# EAGLE design module (EAGLE 7.7.0)
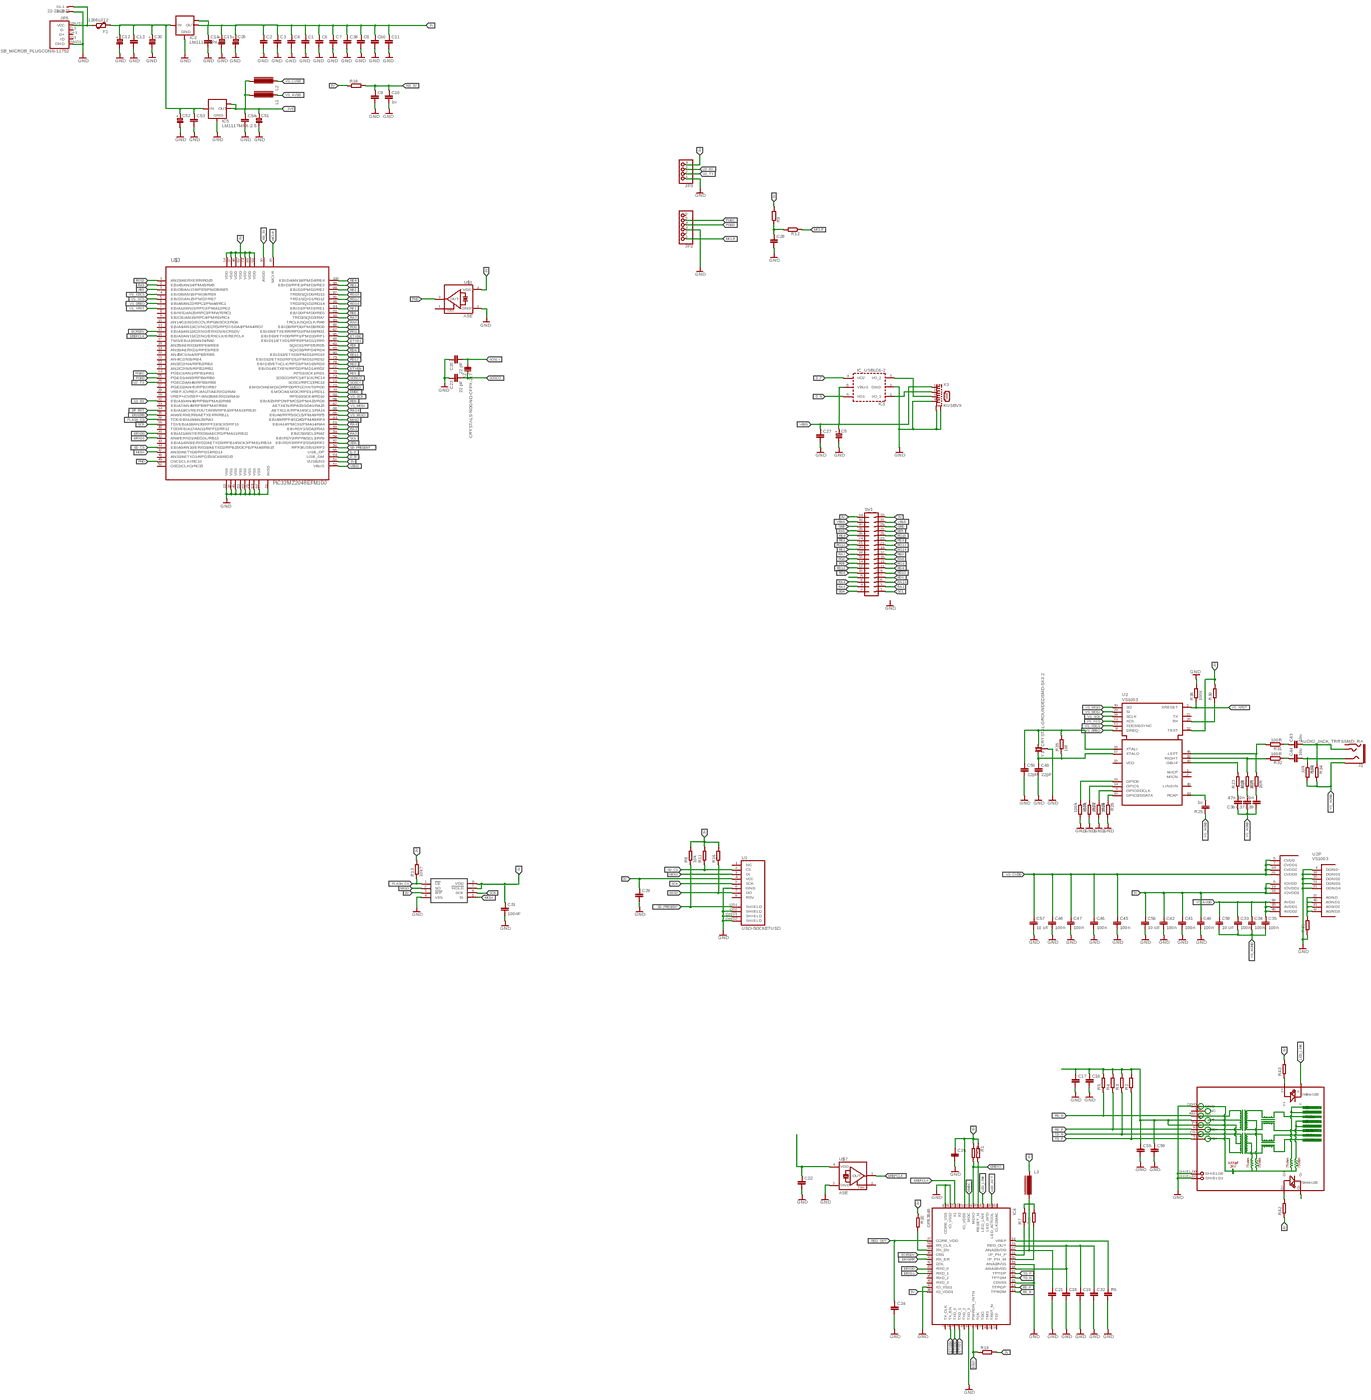
[diagram p0: schematic, sheet 1, overview]
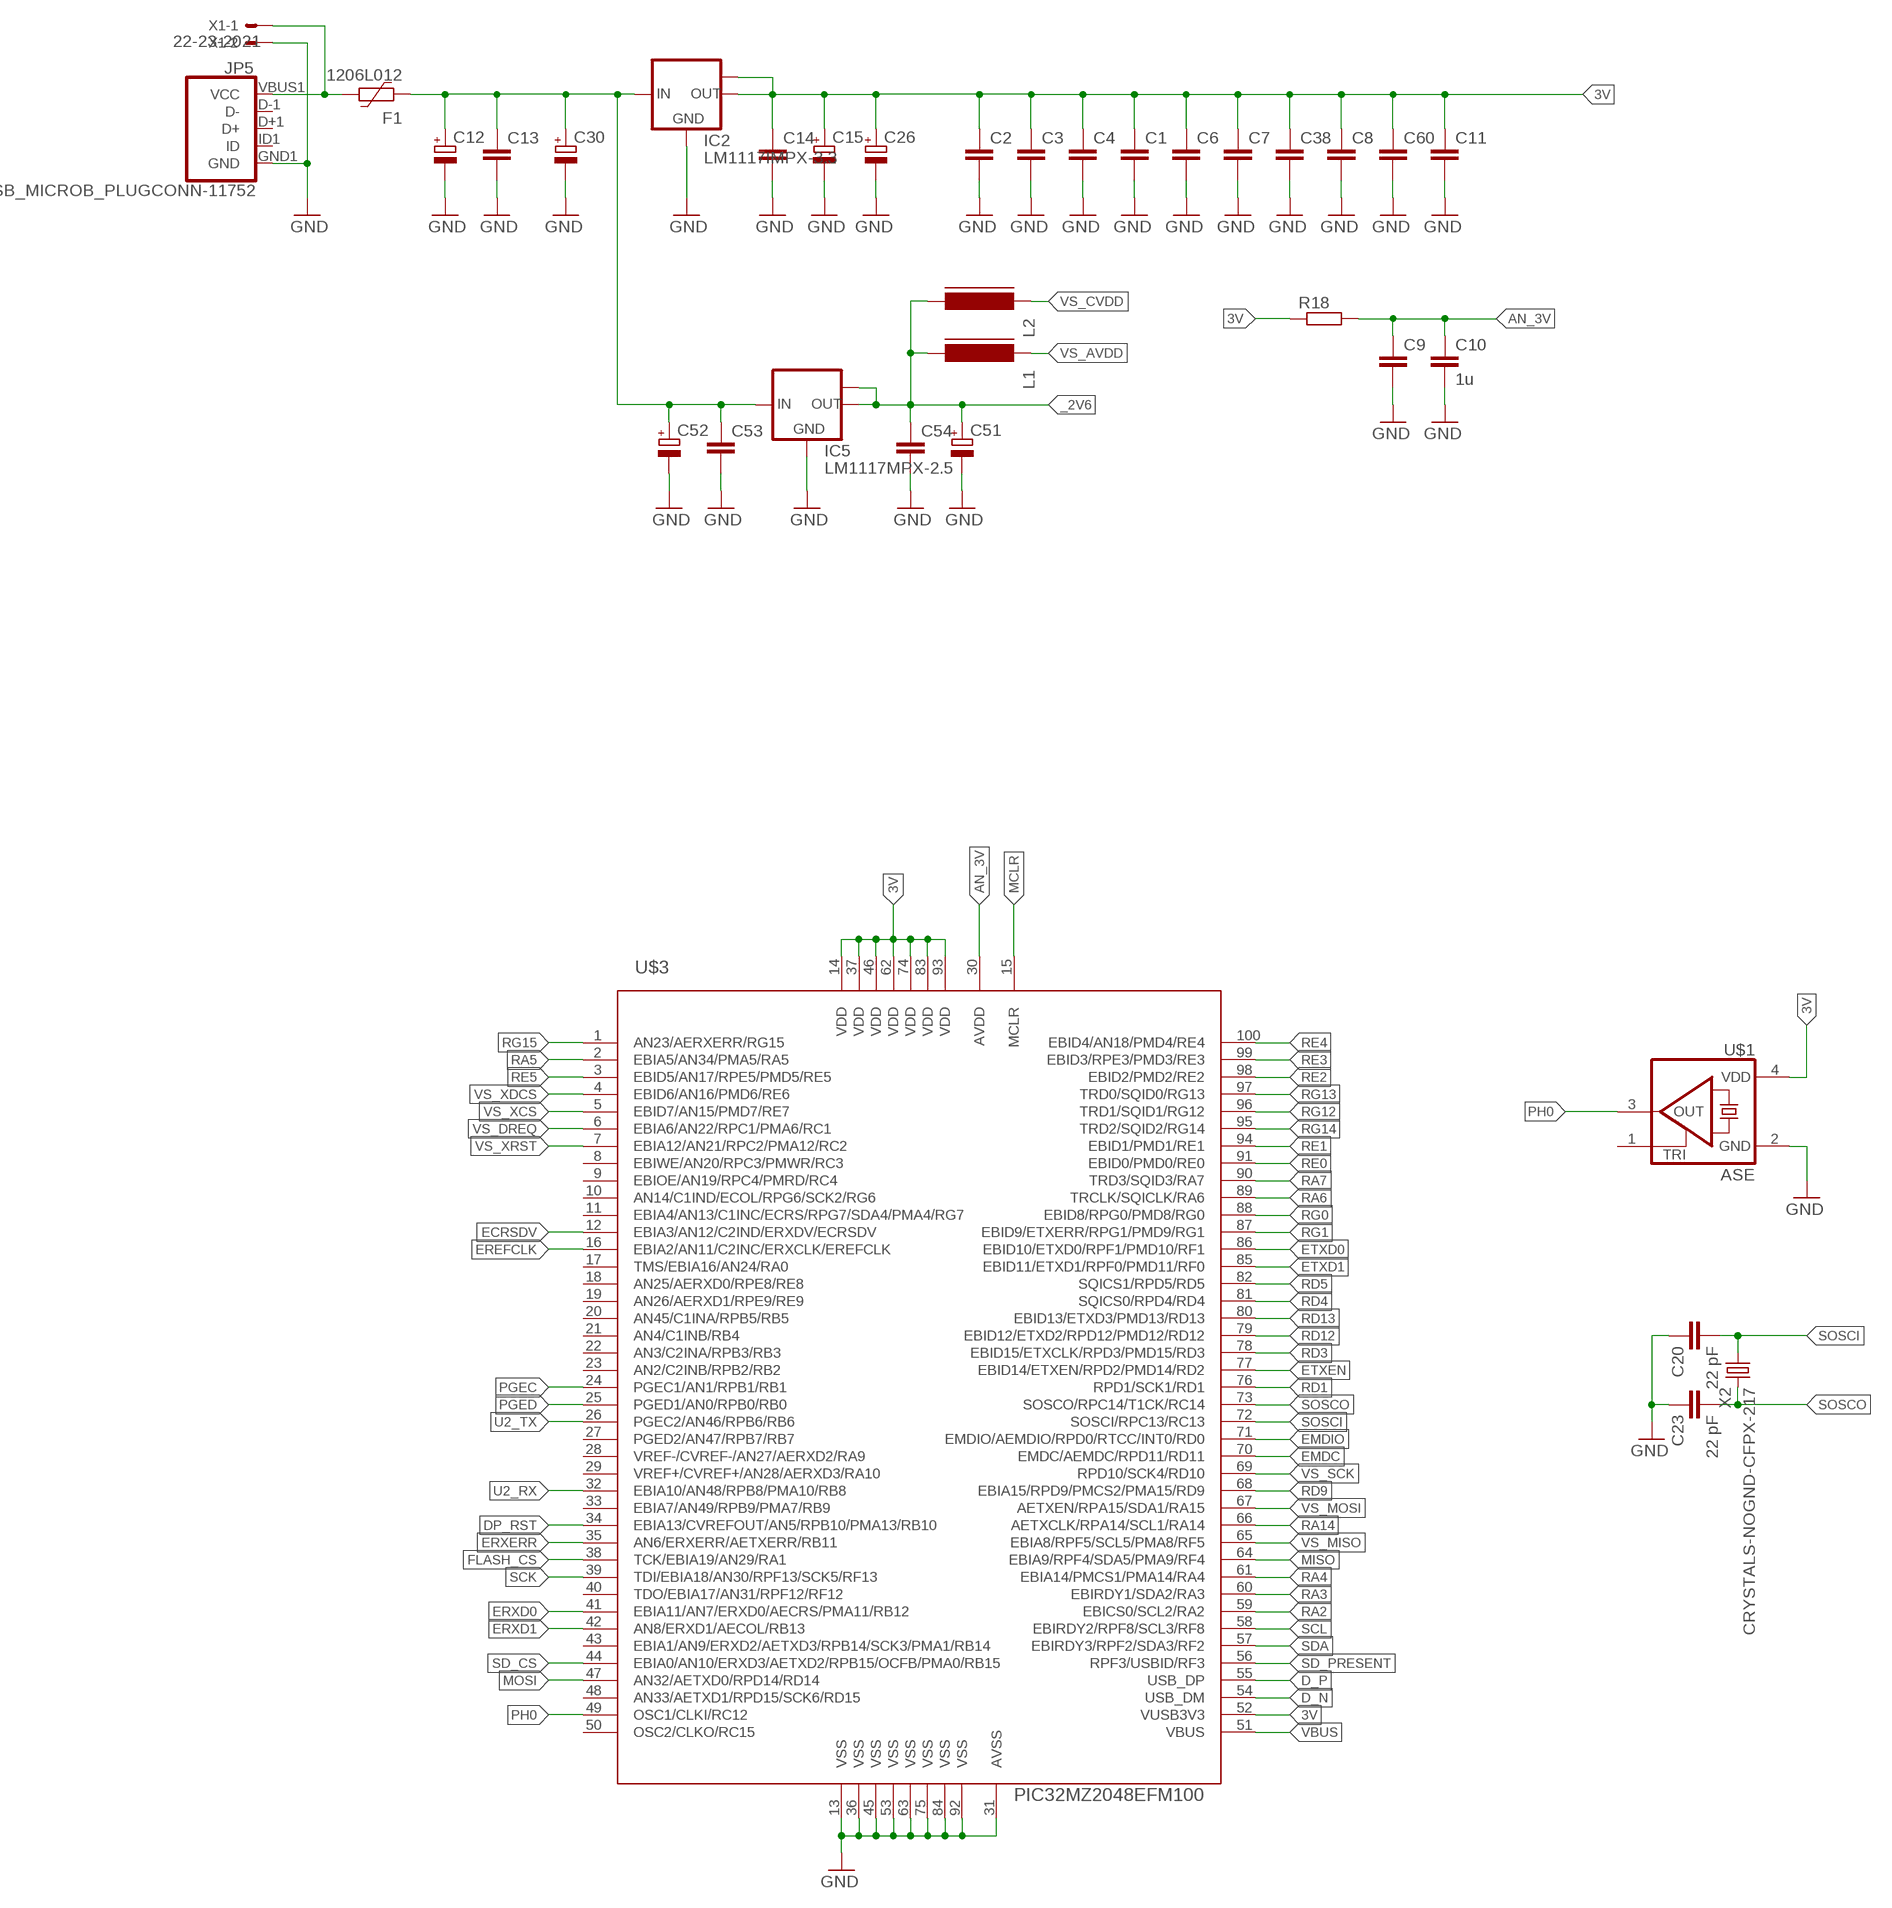
[diagram p1: schematic, sheet 1, part 1 of 4]
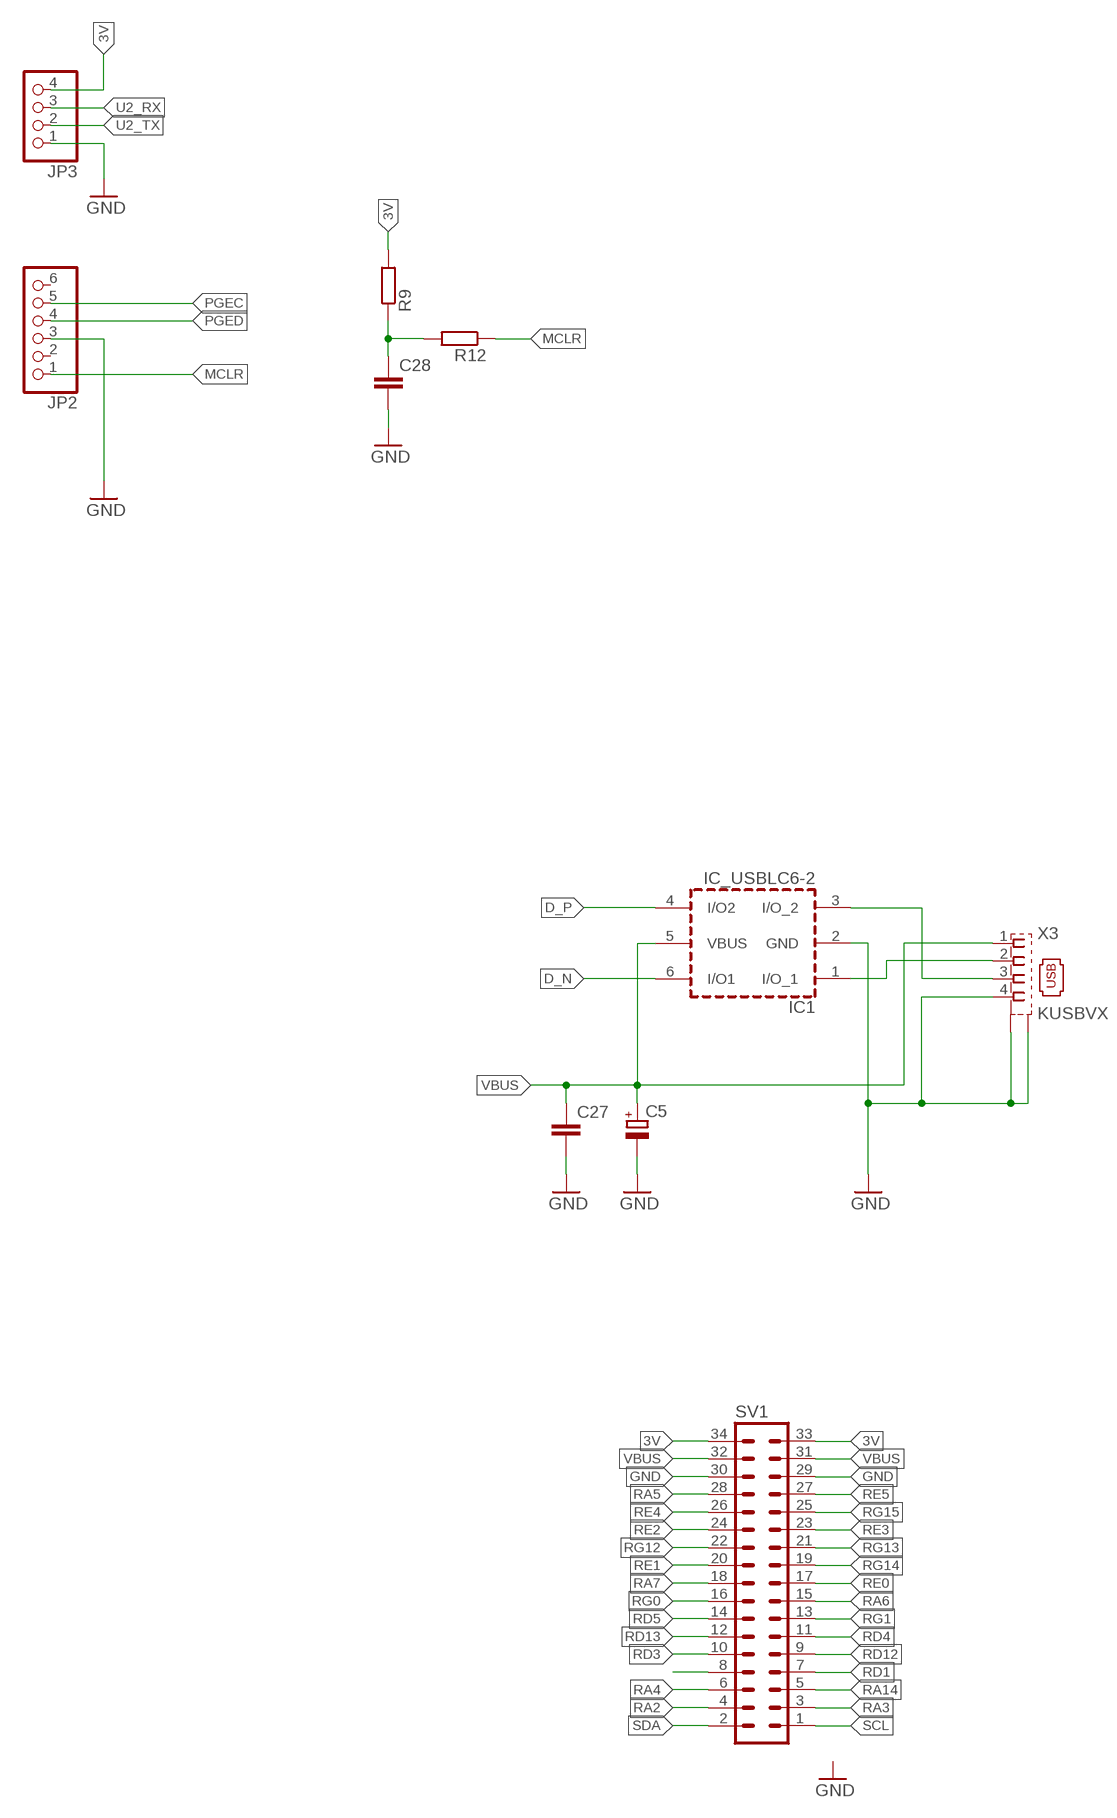
[diagram p2: schematic, sheet 1, part 2 of 4]
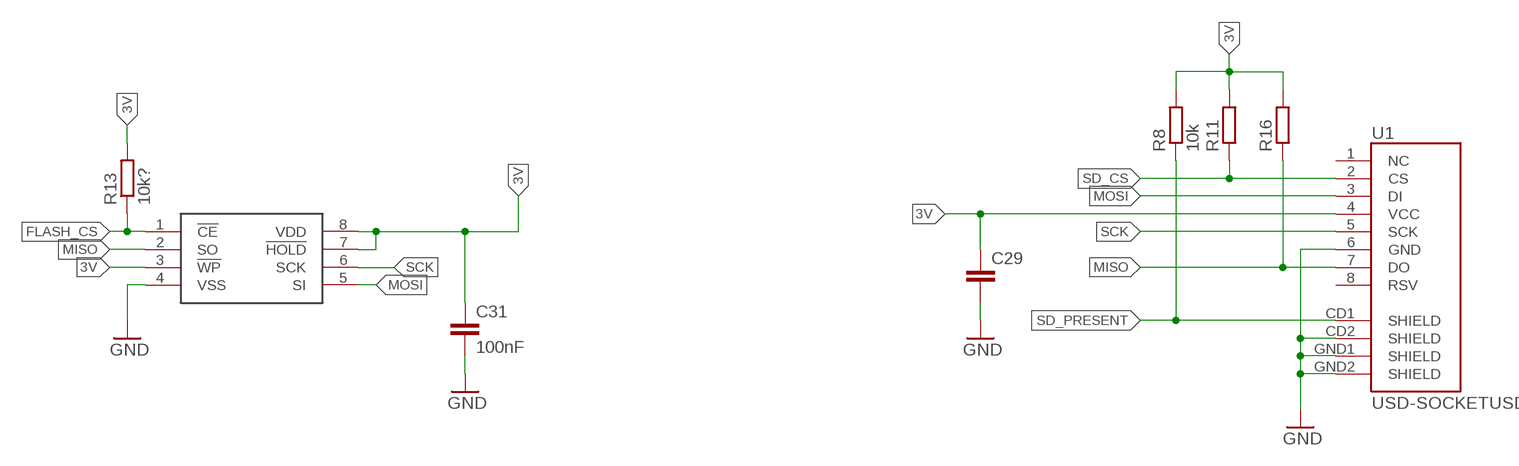
[diagram p3: schematic, sheet 1, part 3 of 4]
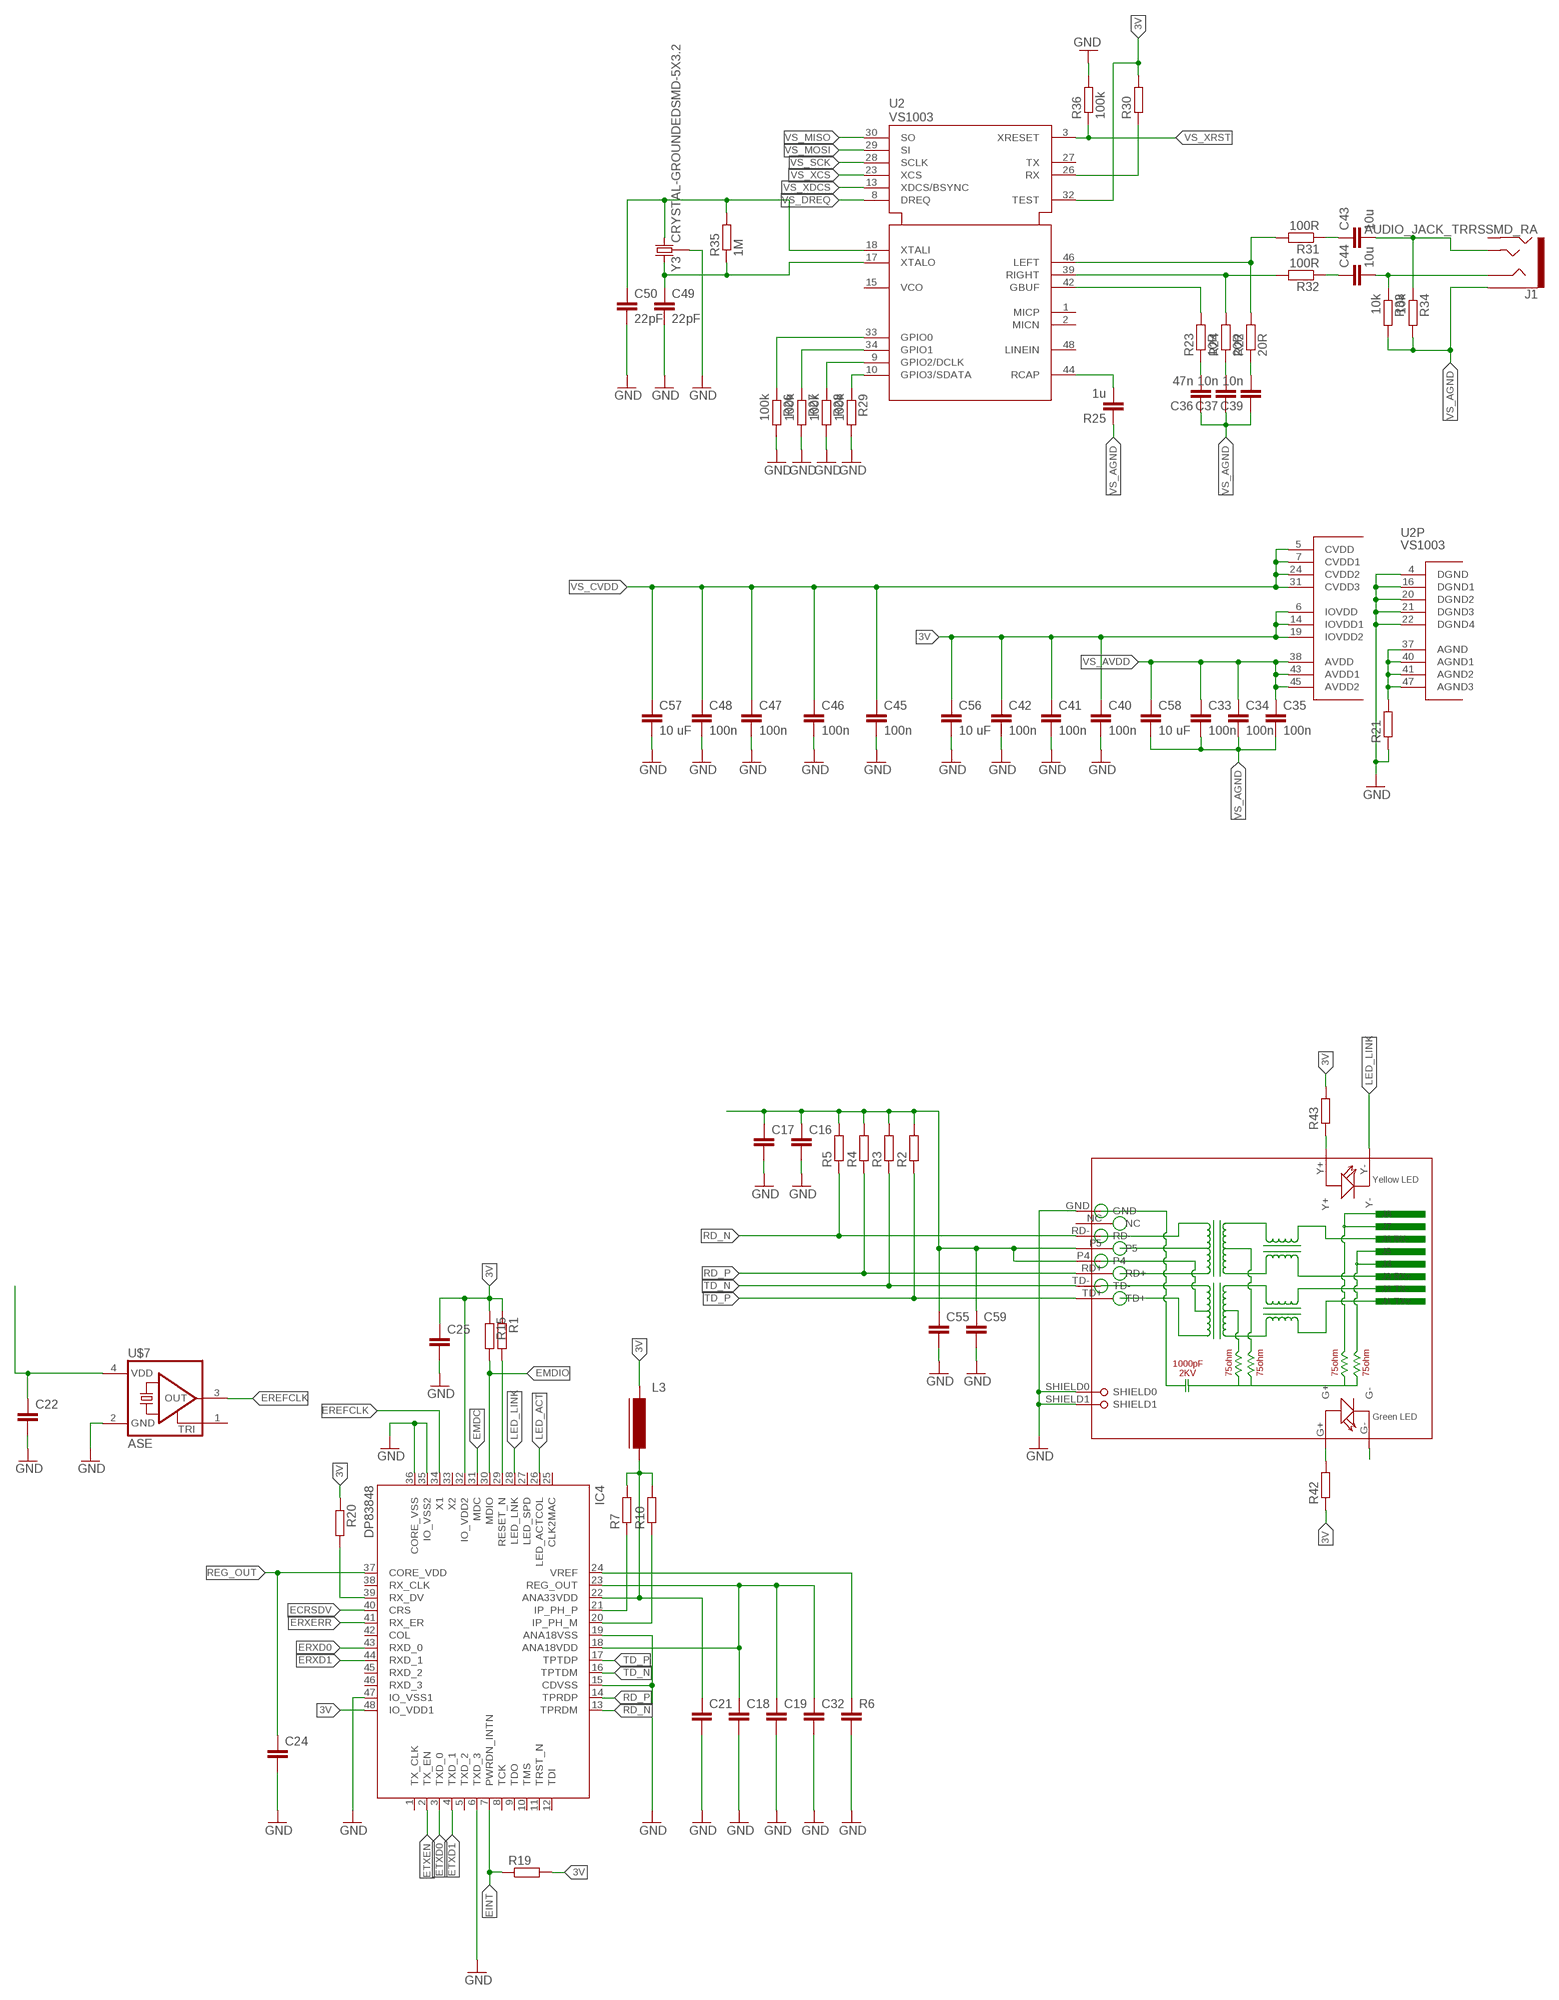
[diagram p4: schematic, sheet 1, part 4 of 4]

## Parts
C1  C-EUC0402  [C0402]
C2  C-EUC0402  [C0402]
C3  C-EUC0402  [C0402]
C4  C-EUC0402  [C0402]
C5  CPOL-EUSMCA  [SMC_A]
C6  C-EUC0402  [C0402]
C7  C-EUC0402  [C0402]
C8  C-EUC0402  [C0402]
C9  C-EUC0402  [C0402]
C10  1u  C-EUC0603  [C0603]
C11  C-EUC0402  [C0402]
C12  CPOL-EUSMCB  [SMC_B]
C13  C-EUC0603  [C0603]
C14  C-EUC0603  [C0603]
C15  CPOL-EUSMCB  [SMC_B]
C16  C-EUC0603  [C0603]
C17  C-EUC0603  [C0603]
C18  C-EUC0402  [C0402]
C19  C-EUC0402  [C0402]
C20  22 pF  C-EUC0603  [C0603]
C21  C-EUC0402  [C0402]
C22  C-EUC0402  [C0402]
C23  22 pF  C-EUC0603  [C0603]
C24  C-EUC0603  [C0603]
C25  C-EUC0603  [C0603]
C26  CPOL-EUSMCA  [SMC_A]
C27  C-EUC0603  [C0603]
C28  C-EUC0603  [C0603]
C29  C-EUC0603  [C0603]
C30  CPOL-EUSMCA  [SMC_A]
C31  100nF  C-EUC0603  [C0603]
C32  C-EUC0603  [C0603]
C33  100n  C-EUC0603  [C0603]
C34  100n  C-EUC0603  [C0603]
C35  100n  C-EUC0603  [C0603]
C36  47n  C-EUC0603  [C0603]
C37  10n  C-EUC0603  [C0603]
C38  C-EUC0402  [C0402]
C39  10n  C-EUC0603  [C0603]
C40  100n  C-EUC0402  [C0402]
C41  100n  C-EUC0402  [C0402]
C42  100n  C-EUC0402  [C0402]
C43  10u  C-EUC0603  [C0603]
C44  10u  C-EUC0603  [C0603]
C45  100n  C-EUC0402  [C0402]
C46  100n  C-EUC0603  [C0603]
C47  100n  C-EUC0603  [C0603]
C48  100n  C-EUC0603  [C0603]
C49  22pF  C-EUC0603  [C0603]
C50  22pF  C-EUC0603  [C0603]
C51  CPOL-EUSMCB  [SMC_B]
C52  CPOL-EUSMCB  [SMC_B]
C53  C-EUC1206  [C1206]
C54  C-EUC1206  [C1206]
C55  C-EUC0603  [C0603]
C56  10 uF  C-EUC0603  [C0603]
C57  10 uF  C-EUC0603  [C0603]
C58  10 uF  C-EUC0603  [C0603]
C59  C-EUC0603  [C0603]
C60  C-EUC0402  [C0402]
F1  1206L012  [1206L]
IC1  IC_USBLC6-2  [SOT-23-6L]
IC2  LM1117IMPX-3.3  [SOT223]
IC4  DP83848  [LQFP48]
IC5  LM1117MPX-2.5  [SOT223]
J1  AUDIO_JACK_TRRSSMD_RA  [AUDIO_JACK_3.5MM_TRRS_SMD_RA]
JP2  PINHD-1X6  [1X06]
JP3  PINHD-1X4  [1X04]
JP5  USB_MICROB_PLUGCONN-11752  [USB-B-MICRO-SMD_V03]
L1  FERRITE-0805  [FB805]
L2  FERRITE-0805  [FB805]
L3  FERRITE-0805  [FB805]
R1  R-EU_R0402  [R0402]
R2  R-EU_R0603  [R0603]
R3  R-EU_R0603  [R0603]
R4  R-EU_R0603  [R0603]
R5  R-EU_R0603  [R0603]
R6  C-EUC0603  [C0603]
R7  R-EU_R0402  [R0402]
R8  10k  R-EU_R0603  [R0603]
R9  R-EU_R0603  [R0603]
R10  R-EU_R0402  [R0402]
R11  R-EU_R0603  [R0603]
R12  R-EU_R0402  [R0402]
R13  10k?  R-EU_R0603  [R0603]
R15  R-EU_R0603  [R0603]
R16  R-EU_R0603  [R0603]
R18  R-EU_R0805  [R0805]
R19  R-EU_R0402  [R0402]
R20  R-EU_R0603  [R0603]
R21  R-EU_R0603  [R0603]
R22  20R  R-EU_R0603  [R0603]
R23  10R  R-EU_R0603  [R0603]
R24  20R  R-EU_R0603  [R0603]
R25  1u  C-EUC0603  [C0603]
R26  100k  R-EU_R0402  [R0402]
R27  100k  R-EU_R0402  [R0402]
R28  100k  R-EU_R0402  [R0402]
R29  100k  R-EU_R0402  [R0402]
R30  R-EU_0204/7  [0204/7]
R31  100R  R-EU_R0603  [R0603]
R32  100R  R-EU_R0603  [R0603]
R33  10k  R-EU_R0603  [R0603]
R34  10k  R-EU_R0603  [R0603]
R35  1M  R-EU_R0603  [R0603]
R36  100k  R-EU_R0603  [R0603]
R42  R-EU_R0603  [R0603]
R43  R-EU_R0603  [R0603]
RJ1  HR911105A  [HR911105A]
SV1  ML34L  [ML34L]
U1  USD-SOCKETUSD  [USD-SOCKET-PP]
U2  VS1003  [LQFP48]
U$1  ASE  [ASE]
U$2  SST25VF016BSO8M  [SO-08M]
U$3  PIC32MZ2048EFM100  [TQFP100_12X12]
U$7  ASE  [ASE]
X1  22-23-2021  [22-23-2021]
X2  CRYSTALS-NOGND-CFPX-217  [3.2X1.5-2-PAD]
X3  KUSBVX  [KUSBVX]
Y3  CRYSTAL-GROUNDEDSMD-5X3.2  [CRYSTAL-SMD-5X3.2-4PAD]

## Nets
3V: C1.1 C2.1 C3.1 C4.1 C6.1 C7.1 C8.1 C11.1 C14.1 C15.+ C22.1 C25.1 C26.+ C29.1 C31.1 C38.1 C40.1 C41.1 C42.1 C56.1 C60.1 IC2.2(OUT) IC2.TAB(OUT1) IC4.32(IO_VDD2) IC4.48(IO_VDD1) JP3.4 L3.1 R1.1 R8.2 R9.2 R11.2 R13.2 R15.1 R16.2 R18.1 R19.2 R20.1 R30.2 R42.1 R43.2 SV1.33 SV1.34 U1.4(VCC) U2.6(IOVDD) U2.14(IOVDD1) U2.19(IOVDD2) U2.32(TEST) U$1.4(VDD) U$2.3(!WP) U$2.7(!HOLD) U$2.8(VDD) U$3.14(VDD) U$3.37(VDD) U$3.46(VDD) U$3.52(VUSB3V3) U$3.62(VDD) U$3.74(VDD) U$3.83(VDD) U$3.93(VDD) U$7.4(VDD)
_2V6: C51.+ C54.1 IC5.2(OUT) IC5.TAB(OUT1) L1.2 L2.2
A3V: C16.1 C17.1 C21.1 C55.1 C59.1 IC4.22(ANA33VDD) L3.2 R2.2 R3.2 R4.2 R5.2 R7.2 R10.2 RJ1.P4 RJ1.P5
AN_3V: C9.1 C10.1 R18.2 U$3.30(AVDD)
D2_N: IC1.1(I/O_1) X3.2
D2_P: IC1.3(I/O_2) X3.3
D_N: IC1.6(I/O1) U$3.54(USB_DM)
D_P: IC1.4(I/O2) U$3.55(USB_DP)
DP_RST: IC4.29(RESET_N) R1.2 U$3.34(EBIA13/CVREFOUT/AN5/RPB10/PMA13/RB10)
ECRSDV: IC4.40(CRS) U$3.12(EBIA3/AN12/C2IND/ERXDV/ECRSDV)
EINT: IC4.7(PWRDN_INTN) R19.1
EMDC: IC4.31(MDC) U$3.70(EMDC/AEMDC/RPD11/RD11)
EMDIO: IC4.30(MDIO) R15.2 U$3.71(EMDIO/AEMDIO/RPD0/RTCC/INT0/RD0)
EREFCLK: IC4.34(X1) U$3.16(EBIA2/AN11/C2INC/ERXCLK/EREFCLK) U$7.3(OUT)
ERXD0: IC4.43(RXD_0) U$3.41(EBIA11/AN7/ERXD0/AECRS/PMA11/RB12)
ERXD1: IC4.44(RXD_1) U$3.42(AN8/ERXD1/AECOL/RB13)
ERXERR: IC4.41(RX_ER) U$3.35(AN6/ERXERR/AETXERR/RB11)
ETXD0: IC4.3(TXD_0) U$3.86(EBID10/ETXD0/RPF1/PMD10/RF1)
ETXD1: IC4.4(TXD_1) U$3.85(EBID11/ETXD1/RPF0/PMD11/RF0)
ETXEN: IC4.2(TX_EN) U$3.77(EBID14/ETXEN/RPD2/PMD14/RD2)
FLASH_CS: R13.1 U$2.1(!CE) U$3.38(TCK/EBIA19/AN29/RA1)
GND: C1.2 C2.2 C3.2 C4.2 C5.- C6.2 C7.2 C8.2 C9.2 C10.2 C11.2 C12.- C13.2 C14.2 C15.- C16.2 C17.2 C18.2 C19.2 C20.1 C21.2 C22.2 C23.1 C24.2 C25.2 C26.- C27.2 C28.2 C29.2 C30.- C31.2 C32.2 C38.2 C40.2 C41.2 C42.2 C45.2 C46.2 C47.2 C48.2 C49.2 C50.2 C51.- C52.- C53.2 C54.2 C55.2 C56.2 C57.2 C59.2 C60.2 IC1.2(GND) IC2.1(GND) IC4.6(TXD_3) IC4.15(CDVSS) IC4.19(ANA18VSS) IC4.35(IO_VSS2) IC4.36(CORE_VSS) IC4.47(IO_VSS1) IC5.1(GND) JP2.3 JP3.1 JP5.GND1(GND) R6.2 R21.1 R26.2 R27.2 R28.2 R29.2 R36.2 RJ1.GND RJ1.SHIELD0 RJ1.SHIELD1 SV1.29 SV1.30 U1.6(GND) U1.CD2(SHIELD) U1.GND1(SHIELD) U1.GND2(SHIELD) U2.4(DGND) U2.16(DGND1) U2.20(DGND2) U2.21(DGND3) U2.22(DGND4) U$1.2(GND) U$2.4(VSS) U$3.13(VSS) U$3.31(AVSS) U$3.36(VSS) U$3.45(VSS) U$3.53(VSS) U$3.63(VSS) U$3.75(VSS) U$3.84(VSS) U$3.92(VSS) U$7.2(GND) X1.2 X3.4 X3.M1(S1) X3.M2(S2) Y3.2 Y3.4
LED_ACT: IC4.26(LED_ACTCOL) RJ1.G-
LED_LINK: IC4.28(LED_LNK) RJ1.Y-
MCLR: JP2.1 R12.1 U$3.15(MCLR)
MISO: R16.1 U1.7(DO) U$2.2(SO) U$3.64(EBIA9/RPF4/SDA5/PMA9/RF4)
MOSI: U1.3(DI) U$2.5(SI) U$3.47(AN32/AETXD0/RPD14/RD14)
N$1: IC4.21(IP_PH_P) R7.1
N$2: C28.1 R9.1 R12.2
N$3: IC4.24(VREF) R6.1
N$6: IC4.20(IP_PH_M) R10.1
N$12: R42.2 RJ1.G+
N$17: F1.1 JP5.VBUS1(VCC) X1.1
N$18: C36.2 R23.1
N$19: R43.1 RJ1.Y+
PGEC: JP2.5 U$3.24(PGEC1/AN1/RPB1/RB1)
PGED: JP2.4 U$3.25(PGED1/AN0/RPB0/RB0)
PH0: U$1.3(OUT) U$3.49(OSC1/CLKI/RC12)
RA2: SV1.4 U$3.59(EBICS0/SCL2/RA2)
RA3: SV1.3 U$3.60(EBIRDY1/SDA2/RA3)
RA4: SV1.6 U$3.61(EBIA14/PMCS1/PMA14/RA4)
RA5: SV1.28 U$3.2(EBIA5/AN34/PMA5/RA5)
RA6: SV1.15 U$3.89(TRCLK/SQICLK/RA6)
RA7: SV1.18 U$3.90(TRD3/SQID3/RA7)
RA14: SV1.5 U$3.66(AETXCLK/RPA14/SCL1/RA14)
RD1: SV1.7 U$3.76(RPD1/SCK1/RD1)
RD3: SV1.10 U$3.78(EBID15/ETXCLK/RPD3/PMD15/RD3)
RD4: SV1.11 U$3.81(SQICS0/RPD4/RD4)
RD5: SV1.14 U$3.82(SQICS1/RPD5/RD5)
RD9: SV1.8 U$3.68(EBIA15/RPD9/PMCS2/PMA15/RD9)
RD12: SV1.9 U$3.79(EBID12/ETXD2/RPD12/PMD12/RD12)
RD13: SV1.12 U$3.80(EBID13/ETXD3/PMD13/RD13)
RD_N: IC4.13(TPRDM) R5.1 RJ1.RD-
RD_P: IC4.14(TPRDP) R4.1 RJ1.RD+
RE0: SV1.17 U$3.91(EBID0/PMD0/RE0)
RE1: SV1.20 U$3.94(EBID1/PMD1/RE1)
RE2: SV1.24 U$3.98(EBID2/PMD2/RE2)
RE3: SV1.23 U$3.99(EBID3/RPE3/PMD3/RE3)
RE4: SV1.26 U$3.100(EBID4/AN18/PMD4/RE4)
RE5: SV1.27 U$3.3(EBID5/AN17/RPE5/PMD5/RE5)
REG_OUT: C18.1 C19.1 C24.1 C32.1 IC4.18(ANA18VDD) IC4.23(REG_OUT) IC4.37(CORE_VDD)
RG0: SV1.16 U$3.88(EBID8/RPG0/PMD8/RG0)
RG1: SV1.13 U$3.87(EBID9/ETXERR/RPG1/PMD9/RG1)
RG12: SV1.22 U$3.96(TRD1/SQID1/RG12)
RG13: SV1.21 U$3.97(TRD0/SQID0/RG13)
RG14: SV1.19 U$3.95(TRD2/SQID2/RG14)
RG15: SV1.25 U$3.1(AN23/AERXERR/RG15)
RX_DV: IC4.39(RX_DV) R20.2
SCK: U1.5(SCK) U$2.6(SCK) U$3.39(TDI/EBIA18/AN30/RPF13/SCK5/RF13)
SCL: SV1.1 U$3.58(EBIRDY2/RPF8/SCL3/RF8)
SD_CS: R11.1 U1.2(CS) U$3.44(EBIA0/AN10/ERXD3/AETXD2/RPB15/OCFB/PMA0/RB15)
SD_PRESENT: R8.1 U1.CD1(SHIELD) U$3.56(RPF3/USBID/RF3)
SDA: SV1.2 U$3.57(EBIRDY3/RPF2/SDA3/RF2)
SOSCI: C20.2 U$3.72(SOSCI/RPC13/RC13) X2.1
SOSCO: C23.2 U$3.73(SOSCO/RPC14/T1CK/RC14) X2.2
TD_N: IC4.16(TPTDM) R3.1 RJ1.TD-
TD_P: IC4.17(TPTDP) R2.1 RJ1.TD+
U2_RX: JP3.3 U$3.32(EBIA10/AN48/RPB8/PMA10/RB8)
U2_TX: JP3.2 U$3.26(PGEC2/AN46/RPB6/RB6)
VBUS: C5.+ C12.+ C13.1 C27.1 C30.+ C52.+ C53.1 F1.2 IC1.5(VBUS) IC2.3(IN) IC5.3(IN) SV1.31 SV1.32 U$3.51(VBUS) X3.1
VS_AGND: C33.2 C34.2 C35.2 C36.1 C37.1 C39.1 C58.2 J1.EARTH R21.2 R25.1 R33.2 R34.2 U2.37(AGND) U2.40(AGND1) U2.41(AGND2) U2.47(AGND3)
VS_AVDD: C33.1 C34.1 C35.1 C58.1 L1.1 U2.38(AVDD) U2.43(AVDD1) U2.45(AVDD2)
VS_CVDD: C45.1 C46.1 C47.1 C48.1 C57.1 L2.1 U2.5(CVDD) U2.7(CVDD1) U2.24(CVDD2) U2.31(CVDD3)
VS_DREQ: U2.8(DREQ) U$3.6(EBIA6/AN22/RPC1/PMA6/RC1)
VS_MISO: U2.30(SO) U$3.65(EBIA8/RPF5/SCL5/PMA8/RF5)
VS_MOSI: U2.29(SI) U$3.67(AETXEN/RPA15/SDA1/RA15)
VS_N$9: C50.1 R35.2 U2.18(XTALI) Y3.1
VS_N$13: C49.1 R35.1 U2.17(XTALO) Y3.3
VS_N$14: R22.2 R31.2 U2.46(LEFT)
VS_N$15: R23.2 U2.42(GBUF)
VS_N$16: R24.2 R32.2 U2.39(RIGHT)
VS_N$17: R25.2 U2.44(RCAP)
VS_N$24: C37.2 R24.1
VS_N$25: C39.2 R22.1
VS_N$26: R29.1 U2.10(GPIO3/SDATA)
VS_N$27: R28.1 U2.9(GPIO2/DCLK)
VS_N$28: R27.1 U2.34(GPIO1)
VS_N$30: R26.1 U2.33(GPIO0)
VS_N$34: R30.1 U2.26(RX)
VS_N$35: C43.1 R31.1
VS_N$36: C44.1 R32.1
VS_N$37: C44.2 J1.RING1 R33.1
VS_N$38: C43.2 J1.TIP R34.1
VS_SCK: U2.28(SCLK) U$3.69(RPD10/SCK4/RD10)
VS_XCS: U2.23(XCS) U$3.5(EBID7/AN15/PMD7/RE7)
VS_XDCS: U2.13(XDCS/BSYNC) U$3.4(EBID6/AN16/PMD6/RE6)
VS_XRST: R36.1 U2.3(XRESET) U$3.7(EBIA12/AN21/RPC2/PMA12/RC2)
Unconnected: IC4.1(TX_CLK) IC4.5(TXD_2) IC4.8(TCK) IC4.9(TDO) IC4.10(TMS) IC4.11(TRST_N) IC4.12(TDI) IC4.25(CLK2MAC) IC4.27(LED_SPD) IC4.33(X2) IC4.38(RX_CLK) IC4.42(COL) IC4.45(RXD_2) IC4.46(RXD_3) J1.RING2 JP2.2 JP2.6 JP5.D+1(D+) JP5.D-1(D-) JP5.ID1(ID) RJ1.NC U1.1(NC) U1.8(RSV) U2.1(MICP) U2.2(MICN) U2.15(VCO) U2.27(TX) U2.48(LINEIN) U$1.1(TRI) U$3.8(EBIWE/AN20/RPC3/PMWR/RC3) U$3.9(EBIOE/AN19/RPC4/PMRD/RC4) U$3.10(AN14/C1IND/ECOL/RPG6/SCK2/RG6) U$3.11(EBIA4/AN13/C1INC/ECRS/RPG7/SDA4/PMA4/RG7) U$3.17(TMS/EBIA16/AN24/RA0) U$3.18(AN25/AERXD0/RPE8/RE8) U$3.19(AN26/AERXD1/RPE9/RE9) U$3.20(AN45/C1INA/RPB5/RB5) U$3.21(AN4/C1INB/RB4) U$3.22(AN3/C2INA/RPB3/RB3) U$3.23(AN2/C2INB/RPB2/RB2) U$3.27(PGED2/AN47/RPB7/RB7) U$3.28(VREF-/CVREF-/AN27/AERXD2/RA9) U$3.29(VREF+/CVREF+/AN28/AERXD3/RA10) U$3.33(EBIA7/AN49/RPB9/PMA7/RB9) U$3.40(TDO/EBIA17/AN31/RPF12/RF12) U$3.43(EBIA1/AN9/ERXD2/AETXD3/RPB14/SCK3/PMA1/RB14) U$3.48(AN33/AETXD1/RPD15/SCK6/RD15) U$3.50(OSC2/CLKO/RC15) U$7.1(TRI)

## Library data of the parts
C1-C4 C6-C11 C13 C14 C16-C25 C27-C29 C31-C50 C53-C60 R6 R25 = rcl:C-EU: CAPACITOR, European symbol
C5 C12 C15 C26 C30 C51 C52 = rcl:CPOL-EU: POLARIZED CAPACITOR, European symbol
F1 = polyfuse-smd_10:?: Polyfuse Resettable PTC Source: http://www.littelfuse.com/products/resettable-ptcs.aspx; MF: Littelfuse; MPN: 1206L012; OC_FARNELL: 1596988; OC_NEWARK: 05M2298
IC1 = dp_devices:IC_USBLC6-2
IC2 = lm1117:LM1117IMPX-*
IC4 = national-semiconductor:DP83848: PHYTER® - Extended Temperature Single Port 10/100 Mb/s Ethernet Physical Layer Transceiver Auto generated by make-symbol-device-package-bsdl.ulp Rev. 34 Source: dp83848yb.bsdl http://www.national.com/ds/DP/DP83848VYB.pdf; MPN: DP83848VYB; OC_FARNELL: 1286817; OC_NEWARK: 11N4484
IC5 = lm1117:LM1117MPX-*
J1 = SparkFun-Connectors:AUDIO_JACK_TRRS: Audio Jack - 3.5mm TRRS (SMD) This is a 3.5mm TRRS SMD audio jack. TRRS connectors are the audio-style connectors that you see on some phones, MP3 players and development boards. TRRS stands for “tip, ring, ring, sleeve,” which reflects that this has three conductors and a ground. SparkFun Products: Audio Jack <https://www.sparkfun.com/products/12639> mbed Starter Kit <https://www.sparkfun.com/products/12968> SparkFun TRRS 3.5mm Jack Breakout <https://www.sparkfun.com/products/11570>; PROD_ID: CONN-10676; SF_ID: PRT-12639
JP2 = pinhead:PINHD-1X6: PIN HEADER
JP3 = pinhead:PINHD-1X4: PIN HEADER
JP5 = SparkFun-Connectors:USB_MICROB_PLUG: USB Micro-B connectors Some male, some female. Watch your step!; PROD_ID: CONN-11752
L1-L3 = dp_devices:FERRITE: Ferrite bead in various packages
R1-R5 R7-R13 R15 R16 R18-R24 R26-R36 R42 R43 = rcl:R-EU_: RESISTOR, European symbol
RJ1 = hanrun:HR911105A
SV1 = con-harting-ml:ML34: HARTING; OC_FARNELL: unknown; OC_NEWARK: unknown
U1 = SparkFun-Connectors:USD-SOCKET: microSD Socket Push-push type uSD socket. Schematic element and footprint production proven. Spark Fun Electronics SKU : PRT-00127. tDoc lines correctly indicate media card edge positions when inserting (unlocked, locked, depressed).
U2 = vlsi-web:VS1003: MP3 / WMA / MIDI Audio Codec Circuit
U$1 U$7 = crystal:ASE: 3.3Vdc CMOS SMD CRYSTAL CLOCK OSCILLATOR SOurce: www.abracon.com; OC_FARNELL: unknown; OC_NEWARK: unknown
U$2 = mw:SST25VF016B
U$3 = mw:PIC32MZ2048EFM100
X1 = con-molex:22-23-2021: .100" (2.54mm) Center Header - 2 Pin; MF: MOLEX; MPN: 22-23-2021; OC_FARNELL: 1462926; OC_NEWARK: 25C3832
X2 = IQD-Frequency-Products:CRYSTALS-NOGND: CRYSTALS CAN NOT GROUNDED
X3 = con-kycon:KUSBVX: Vertical,Top Entry Universal Serial Bus Connector KUSBVX Series Source: KYCON Sibalco USB vertical socket KUSBV.pdf
Y3 = SparkFun-Clocks:CRYSTAL-GROUNDED: Crystals w/ Ground Pin (Generic) These are passive quartz crystals, which can be used as a clock source for a microcontroller. Crystal's are usually two-terminal devices. A third terminal may be optionally connected to ground, as recommended by the manufaturer.

## Board
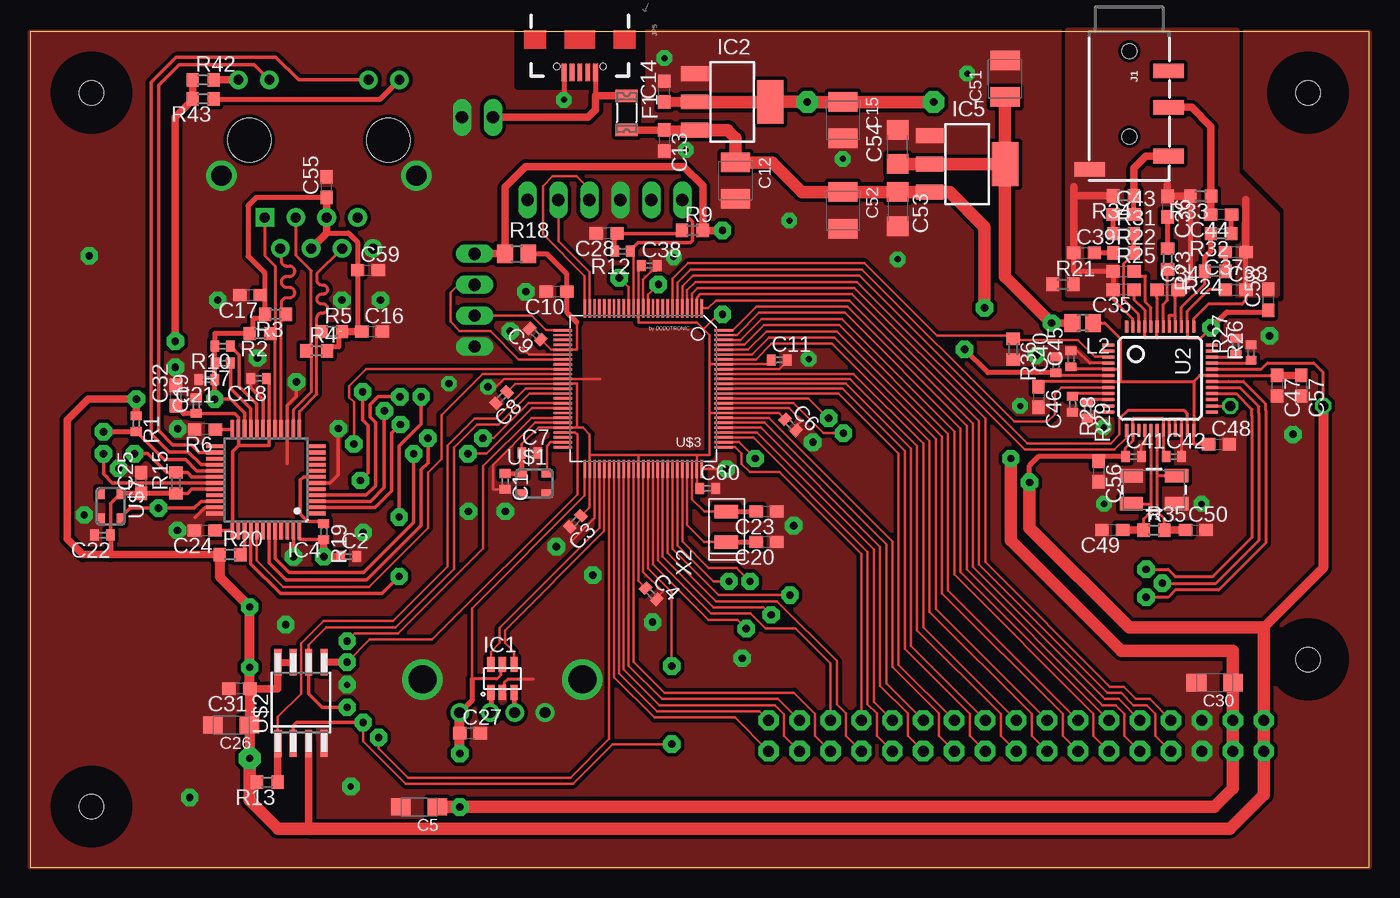
[diagram p5: board, top side]
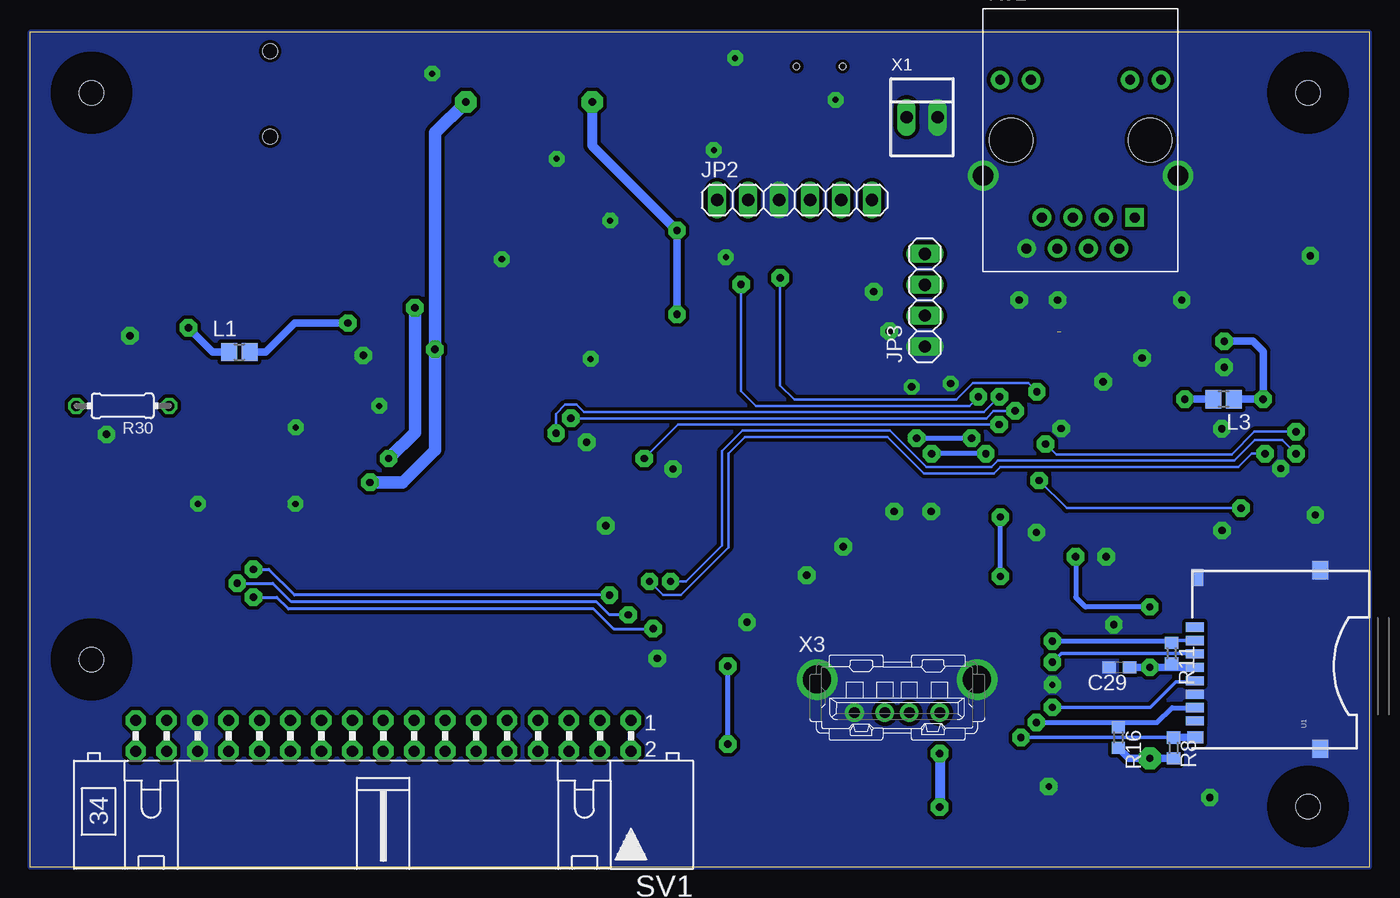
[diagram p6: board, bottom side, seen from below]

Size 109.86 x 68.58 mm. Coordinates in mm from the lower left corner, seen from the top.
Outline: 0,0 109.86,0 109.86,68.58 0,68.58 0,0
Copper layers (1*16): Top 0.035mm / dielectric 1.5mm / Bottom 0.035mm
Design rules "default *": minimum track width 10mil, minimum drill 24mil, track to track 8mil, track to pad 8mil, pad to pad 8mil, via to via 8mil, smd to smd 8mil, copper to edge 0mil, drill to drill 8mil, minimum pad ring 10mil, minimum via ring 8mil, stop-mask expansion 4mil, vias tented up to drill 0mil, thermal gap 10mil
Holes 2 mm at 5,5 104.86,17.07 104.86,63.58 5,63.58
tRestrict: area 55,32 to 55.3,33.9; area 37.5,14.6 to 40,16.5; area 48,61 to 49.8,62.8; area 40,64.1 to 50.2,68.6; area 2,2 to 8,8; area 101.8,14 to 107.9,20.1; area 101.8,60.5 to 107.9,66.6; area 2,60.5 to 8,66.6; area 89.8,43.9 to 95.6,44.9; area 87.9,37.2 to 89,43; area 96.4,37.2 to 97.5,43; area 89.8,35.4 to 95.6,37.3
bRestrict: area 2,2 to 8,8; area 101.8,14 to 107.9,20.1; area 101.8,60.5 to 107.9,66.6; area 2,60.5 to 8,66.6

### Footprints (pad centres in the part's own frame; a part is rotated, then mirrored left to right if it is on the bottom)
C0402 = smd 0.7 x 0.9: 1 -0.65,0; 2 0.65,0
SMC_A = smd 1.6 x 1.4: + -1.5,0; - 1.5,0
C0603 = smd 1.1 x 1: 1 -0.85,0; 2 0.85,0
SMC_B = smd 1.6 x 2.4: + -1.5,0; - 1.5,0
C1206 = smd 1.6 x 1.8: 1 -1.4,0; 2 1.4,0
1206L = smd 1 x 1.8: 1 -1.4,0; 2 1.4,0
SOT-23-6L = smd 0.6 x 1.2: 1 -0.95,-2.3; 2 0,-2.3; 3 0.95,-2.3; 4 0.95,0; 5 0,0; 6 -0.95,0
SOT223 = smd 1.219 x 2.235: 1 -2.311,-3.099; 2 0,-3.099; 3 2.311,-3.099 | smd 3.6 x 2.2: TAB 0,3.099
LQFP48 = smd 1.5 x 0.3: 1 -4.15,2.75; 2 -4.15,2.25; 3 -4.15,1.75; 4 -4.15,1.25; 5 -4.15,0.75; 6 -4.15,0.25; 7 -4.15,-0.25; 8 -4.15,-0.75; 9 -4.15,-1.25; 10 -4.15,-1.75; 11 -4.15,-2.25; 12 -4.15,-2.75; 25 4.15,-2.75; 26 4.15,-2.25; 27 4.15,-1.75; 28 4.15,-1.25; 29 4.15,-0.75; 30 4.15,-0.25; 31 4.15,0.25; 32 4.15,0.75; 33 4.15,1.25; 34 4.15,1.75; 35 4.15,2.25; 36 4.15,2.75 | smd 0.3 x 1.5: 13 -2.75,-4.15; 14 -2.25,-4.15; 15 -1.75,-4.15; 16 -1.25,-4.15; 17 -0.75,-4.15; 18 -0.25,-4.15; 19 0.25,-4.15; 20 0.75,-4.15; 21 1.25,-4.15; 22 1.75,-4.15; 23 2.25,-4.15; 24 2.75,-4.15; 37 2.75,4.15; 38 2.25,4.15; 39 1.75,4.15; 40 1.25,4.15; 41 0.75,4.15; 42 0.25,4.15; 43 -0.25,4.15; 44 -0.75,4.15; 45 -1.25,4.15; 46 -1.75,4.15; 47 -2.25,4.15; 48 -2.75,4.15
AUDIO_JACK_3.5MM_TRRS_SMD_RA = smd 1.2 x 2.5: EARTH 11.3,-3.25; RING1 6.2,3.25; RING2 3.2,3.25; TIP 10.2,3.25 | hole 1.2: 1.6,0; 8.6,0
1X06 = drill 1.016 long: 1 -6.35,0; 2 -3.81,0; 3 -1.27,0; 4 1.27,0; 5 3.81,0; 6 6.35,0
1X04 = drill 1.016 long: 1 -3.81,0; 2 -1.27,0; 3 1.27,0; 4 3.81,0
USB-B-MICRO-SMD_V03 = smd 1.4 x 0.4: D+1 2.7,0; D-1 2.7,0.65; GND1 2.7,-1.3; ID1 2.7,-0.65; VBUS1 2.7,1.3 | hole 0.5: 2.2,1.9; 2.2,-1.9
FB805 = smd 1.3 x 1.5: 1 -0.85,0; 2 0.85,0
R0402 = smd 0.7 x 0.9: 1 -0.65,0; 2 0.65,0
R0603 = smd 1 x 1.1: 1 -0.85,0; 2 0.85,0
R0805 = smd 1.3 x 1.5: 1 -0.95,0; 2 0.95,0
0204/7 = drill 0.813 octagon: 1 -3.81,0; 2 3.81,0
HR911105A = drill 0.813 pad 1.524: G+ 4.953,-6.604; G- 4.953,-4.064; GND -8.89,4.445; NC -6.35,3.175; P4 -8.89,-0.635; P5 -6.35,0.635; RD+ -6.35,-1.905; RD- -8.89,1.905; TD- -8.89,-3.175; Y+ 4.953,6.604; Y- 4.953,4.064 | drill 1.651 pad 2.159: SHIELD0 -2.921,8.001; SHIELD1 -2.921,-8.001 | drill 0.813 pad 1.524 square: TD+ -6.35,-4.445 | hole 3.556: 0,-5.715; 0,5.715
ML34L = drill 0.914 pad 1.676 octagon: 1 -20.32,-1.27; 2 -20.32,1.27; 3 -17.78,-1.27; 4 -17.78,1.27; 5 -15.24,-1.27; 6 -15.24,1.27; 7 -12.7,-1.27; 8 -12.7,1.27; 9 -10.16,-1.27; 10 -10.16,1.27; 11 -7.62,-1.27; 12 -7.62,1.27; 13 -5.08,-1.27; 14 -5.08,1.27; 15 -2.54,-1.27; 16 -2.54,1.27; 17 0,-1.27; 18 0,1.27; 19 2.54,-1.27; 20 2.54,1.27; 21 5.08,-1.27; 22 5.08,1.27; 23 7.62,-1.27; 24 7.62,1.27; 25 10.16,-1.27; 26 10.16,1.27; 27 12.7,-1.27; 28 12.7,1.27; 29 15.24,-1.27; 30 15.24,1.27; 31 17.78,-1.27; 32 17.78,1.27; 33 20.32,-1.27; 34 20.32,1.27
USD-SOCKET-PP = smd 0.75 x 1.5: 1 3.2,14.3; 2 2.1,14.3; 3 1,14.3; 4 -0.1,14.3; 5 -1.2,14.3; 6 -2.3,14.3; 7 -3.4,14.3; 8 -4.5,14.3 | smd 1 x 1.3: CD1 -5.85,14.25 | smd 1.4 x 1: CD2 7.275,14.1 | smd 1.5 x 1.35: GND1 -6.775,4; GND2 7.875,4
LQFP48' = smd 0.25 x 1: 1 -2.75,-4.25; 2 -2.25,-4.25; 3 -1.75,-4.25; 4 -1.25,-4.25; 5 -0.75,-4.25; 6 -0.25,-4.25; 7 0.25,-4.25; 8 0.75,-4.25; 9 1.25,-4.25; 10 1.75,-4.25; 11 2.25,-4.25; 12 2.75,-4.25; 25 2.75,4.25; 26 2.25,4.25; 27 1.75,4.25; 28 1.25,4.25; 29 0.75,4.25; 30 0.25,4.25; 31 -0.25,4.25; 32 -0.75,4.25; 33 -1.25,4.25; 34 -1.75,4.25; 35 -2.25,4.25; 36 -2.75,4.25 | smd 1 x 0.25: 13 4.25,-2.75; 14 4.25,-2.25; 15 4.25,-1.75; 16 4.25,-1.25; 17 4.25,-0.75; 18 4.25,-0.25; 19 4.25,0.25; 20 4.25,0.75; 21 4.25,1.25; 22 4.25,1.75; 23 4.25,2.25; 24 4.25,2.75; 37 -4.25,2.75; 38 -4.25,2.25; 39 -4.25,1.75; 40 -4.25,1.25; 41 -4.25,0.75; 42 -4.25,0.25; 43 -4.25,-0.25; 44 -4.25,-0.75; 45 -4.25,-1.25; 46 -4.25,-1.75; 47 -4.25,-2.25; 48 -4.25,-2.75
ASE = smd 0.9 x 0.65: 1 -1.05,-0.825; 2 1.05,-0.825; 3 1.05,0.825; 4 -1.05,0.825
SO-08M = smd 0.6 x 2.2: 1 -1.905,-3.33; 2 -0.635,-3.33; 3 0.635,-3.33; 4 1.905,-3.33; 5 1.905,3.33; 6 0.635,3.33; 7 -0.635,3.33; 8 -1.905,3.33
TQFP100_12X12 = smd 0.2 x 1.5: 1 -4.8,-6.6; 2 -4.4,-6.6; 3 -4,-6.6; 4 -3.6,-6.6; 5 -3.2,-6.6; 6 -2.8,-6.6; 7 -2.4,-6.6; 8 -2,-6.6; 9 -1.6,-6.6; 10 -1.2,-6.6; 11 -0.8,-6.6; 12 -0.4,-6.6; 13 0,-6.6; 14 0.4,-6.6; 15 0.8,-6.6; 16 1.2,-6.6; 17 1.6,-6.6; 18 2,-6.6; 19 2.4,-6.6; 20 2.8,-6.6; 21 3.2,-6.6; 22 3.6,-6.6; 23 4,-6.6; 24 4.4,-6.6; 25 4.8,-6.6; 51 4.8,6.6; 52 4.4,6.6; 53 4,6.6; 54 3.6,6.6; 55 3.2,6.6; 56 2.8,6.6; 57 2.4,6.6; 58 2,6.6; 59 1.6,6.6; 60 1.2,6.6; 61 0.8,6.6; 62 0.4,6.6; 63 0,6.6; 64 -0.4,6.6; 65 -0.8,6.6; 66 -1.2,6.6; 67 -1.6,6.6; 68 -2,6.6; 69 -2.4,6.6; 70 -2.8,6.6; 71 -3.2,6.6; 72 -3.6,6.6; 73 -4,6.6; 74 -4.4,6.6; 75 -4.8,6.6 | smd 1.5 x 0.2: 26 6.6,-4.8; 27 6.6,-4.4; 28 6.6,-4; 29 6.6,-3.6; 30 6.6,-3.2; 31 6.6,-2.8; 32 6.6,-2.4; 33 6.6,-2; 34 6.6,-1.6; 35 6.6,-1.2; 36 6.6,-0.8; 37 6.6,-0.4; 38 6.6,0; 39 6.6,0.4; 40 6.6,0.8; 41 6.6,1.2; 42 6.6,1.6; 43 6.6,2; 44 6.6,2.4; 45 6.6,2.8; 46 6.6,3.2; 47 6.6,3.6; 48 6.6,4; 49 6.6,4.4; 50 6.6,4.8; 76 -6.6,4.8; 77 -6.6,4.4; 78 -6.6,4; 79 -6.6,3.6; 80 -6.6,3.2; 81 -6.6,2.8; 82 -6.6,2.4; 83 -6.6,2; 84 -6.6,1.6; 85 -6.6,1.2; 86 -6.6,0.8; 87 -6.6,0.4; 88 -6.6,0; 89 -6.6,-0.4; 90 -6.6,-0.8; 91 -6.6,-1.2; 92 -6.6,-1.6; 93 -6.6,-2; 94 -6.6,-2.4; 95 -6.6,-2.8; 96 -6.6,-3.2; 97 -6.6,-3.6; 98 -6.6,-4; 99 -6.6,-4.4; 100 -6.6,-4.8
22-23-2021 = drill 1 long: 1 -1.27,0; 2 1.27,0
3.2X1.5-2-PAD = smd 1.1 x 1.9: 1 -1.25,0; 2 1.25,0
KUSBVX = drill 0.9 pad 1.524: 1 3.5,0; 2 1,0; 3 -1,0; 4 -3.5,0 | drill 2.3 pad 2.8: M1 -6.57,2.71; M2 6.57,2.71
CRYSTAL-SMD-5X3.2-4PAD = smd 1.9 x 1.1: 1 -1.85,-1.15; 2 1.85,-1.15; 3 1.85,1.15; 4 -1.85,1.15

### Placement (x,y rotation side)
C1  38.96,31.68 270 top
C2  26.13,25.5 0 top
C3  44.73,28.4 225 top
C4  50.93,22.45 315 top
C5  31.9,4.95 180 top
C6  62.38,36.33 315 top
C7  40.97,34 0 top
C8  38.65,38.56 225 top
C9  41.43,43.77 135 top
C10  43.18,47.25 180 top
C11  61.46,41.64 0 top
C12  57.86,56.36 270 top
C13  52.02,59.66 270 top
C14  52.02,63.68 90 top
C15  66.67,61.34 270 top
C16  28.05,43.98 0 top
C17  18.03,46.96 180 top
C18  18.73,40.13 180 top
C19  13.61,37.91 90 top
C20  60.4,26.7 180 top
C21  14.47,40.03 180 top
C22  5.92,27.28 180 top
C23  60.4,29.2 180 top
C24  14.3,27.65 180 top
C25  9.09,31.55 90 top
C26  16.48,11.68 180 top
C27  36.08,11.02 0 top
C28  47.29,52.03 180 top
C29  20.5,16.41 180 bottom
C30  97.18,15.16 180 top
C31  17.14,14.67 180 top
C32  11.94,38.73 90 top
C33  98.91,47.41 0 top
C34  93.32,47.41 0 top
C35  89.71,47.41 180 top
C36  93.32,54.24 270 top
C37  98.91,50.5 180 top
C38  50.79,49.39 0 top
C39  86.46,50.44 0 top
C40  84.17,41.26 90 top
C41  90.53,33.71 0 top
C42  93.83,33.71 0 top
C43  89.71,53.59 0 top
C44  97.71,53.58 180 top
C45  85.39,41.76 90 top
C46  82.73,38.61 270 top
C47  102.31,39.53 270 top
C48  97.54,34.72 0 top
C49  88.78,27.69 180 top
C50  95.64,27.69 0 top
C51  79.98,64.74 90 top
C52  66.67,53.92 270 top
C53  71.17,54.03 270 top
C54  71.17,59.13 90 top
C55  24.31,55.83 90 top
C56  87.66,32.49 270 top
C57  104.29,39.53 270 top
C58  101.6,46.58 90 top
C59  27.7,49.02 0 top
C60  55.59,31.11 0 top
F1  48.92,61.93 270 top
IC1  38.73,16.66 0 top
IC2  57.61,62.83 270 top
IC4  19.33,31.8 180 top
IC5  76.89,57.73 270 top
J1  90.17,68.58 270 top
JP2  47.14,54.78 0 bottom
JP3  36.45,46.56 90 bottom
JP5  45.09,67.94 270 top
L1  92.71,42.29 0 bottom
L2  86.36,44.68 180 top
L3  11.94,38.43 180 bottom
R1  8.69,36.42 270 top
R2  18.85,43.81 180 top
R3  20.11,45.39 180 top
R4  23.5,42.39 0 top
R5  24.74,43.98 0 top
R6  14.33,35.95 180 top
R7  15.77,41.38 180 top
R8  16.05,9.8 270 bottom
R9  54.33,52.28 0 top
R10  15.77,42.77 180 top
R11  16.21,17.58 270 bottom
R12  48.59,50.57 180 top
R13  19.43,6.99 180 top
R15  11.94,31.55 90 top
R16  20.57,10.65 270 bottom
R18  39.9,50.37 0 top
R19  24.08,27.55 270 top
R20  16.38,25.68 0 top
R21  84.73,47.85 0 top
R22  89.71,50.44 0 top
R23  93.32,49.94 270 top
R24  97.23,48.92 180 top
R25  89.71,48.92 0 top
R26  100.17,42.26 90 top
R27  98.91,42.76 90 top
R28  85.52,38.01 270 top
R29  86.74,37.51 270 top
R30  102.29,37.88 180 bottom
R31  89.71,52.02 0 top
R32  97.71,52.02 180 top
R33  96.04,55.09 180 top
R34  89.7,55.12 180 top
R35  92.21,27.69 0 top
R36  80.64,42.53 270 top
R42  14.17,64.64 0 top
R43  14.17,63.07 180 top
RJ1  23.67,59.69 90 bottom
SV1  80.9,10.79 180 bottom
U1  0,16.51 90 bottom
U2  VS1003  [LQFP48']  92.71,40.13 270 top
U$1  41.35,31.51 0 top
U$2  22.2,13.51 0 top
U$3  50.29,39.29 180 top
U$7  6.58,29.64 270 top
X1  36.68,61.57 0 bottom
X2  57.1,27.95 90 top
X3  38.73,12.7 0 bottom
Y3  92.21,30.99 180 top

### Tracks (layer width: path | path; a pad name or v marks a point on that pad's centre or on a via)
3V  (via drill 0.6 pad 1.42, 0.6 pad 1.78)
  Top 0.203: 49.89,33.86 U$3.62 49.89,23.49 C4.1 | 45.89,33.86 49.89,33.86 | 44.86,36.09 44.86,39.69 U$3.37 39.76,39.67 C8.1 | 55.73,37.29 55.73,33.86 54.69,33.86 | 55.73,37.29 55.73,41.29 | 55.73,41.29 55.73,43.69 55.29,44.13 | 55.29,44.13 54.69,44.73 49.89,44.73 U$3.14 49.89,49.09 C38.1 | 49.89,33.86 54.69,33.86 | 44.86,36.09 U$3.46 41.68,36.09 40.32,34.73 C7.1 | 54.69,33.86 U$3.74 54.69,31.36 C60.1 | 55.73,37.29 U$3.83 61.42,37.29 C6.1 | 55.73,41.29 U$3.93 60.81,41.29 C11.1 | 45.89,33.86 U$3.52 45.89,29.56 C3.1 | 55.29,44.13 55.29,44.22 56.46,45.4 v56.79,45.4 | 45.89,33.86 45.89,35.54 45.34,36.09 44.86,36.09
  Top 0.251: U2.6 84.4,40.38 C40.1 | C42.1 92.96,33.93 U2.19 92.96,36.83 90.46,36.83 U2.14 90.46,35.01 89.88,34.43 C41.1 | R30.2 106.1,40.62 105.31,41.4 101.52,41.4 101,40.88 U2.32
  Top 0.305: IC4.32 13.24,31.05 12.89,30.7 R15.1 | 8.77,30.7 8.76,30.7 | U$7.4 6.58,29.87 6.58,27.36 6.57,27.34 C22.1 | R19.2 22.08,26.9 IC4.48
  Top 0.406: C40.1 78.56,40.61 v76.66,42.51 | C41.1 87.63,33.71 | C56.1 87.66,33.68 87.63,33.71 | 87.63,33.71 82.73,33.71 81.99,32.97 v81.99,31.6 | R13.2 18,6.99 | R15.1 C25.1 8.76,30.7 7.41,30.7 U$7.4 | 17.98,11.44 18,11.43 17.98,11.43 C26.+ | C15.+ 66.67,62.83 | C22.1 6.57,25.68 | C7.1 40.32,32.36 U$1.4 | U$1.4 | C1.1 U$1.4
  Top 0.584: U$2.8 U$2.7
  Top 0.61: v56.79,52.28 R9.2 55.18,55.95 53.59,57.53 40.64,57.53 38.95,55.84 R18.1 JP3.4 | U$2.3 22.84,3.17 | C31.1 20.3,14.67 U$2.8 | R19.2 v24.08,25.5 C2.1 | R20.1 6.57,25.68 4.29,25.68 3,26.98 3,36.7 4.72,38.43 v8.69,38.43 R1.1 | R42.1 R43.2 13.32,63.01 11.88,61.57 v11.88,43.18
  Top 0.813: IC2.2 C14.1 | v18,8.95 18,11.43 C31.1 v18,16.41 v18,21.38 15.53,23.84 R20.1 | R30.2 106.1,24.56 101.22,19.68
  Top 1.016: IC2.2 IC2.TAB 60.72,62.84 63.5,62.84 v63.75,62.83 66.67,62.83 v74.12,62.83 | v18,8.95 18,6.99 18,5.5 20.32,3.17 22.84,3.17 98.42,3.17 101.22,5.97 SV1.34 SV1.33 101.22,19.43 | 100.97,19.68 90.17,19.68 81.99,27.86 v81.99,31.6 | 100.97,19.68 101.22,19.68 101.22,19.43 | 101.22,19.43 100.97,19.68
  Bottom 0.406: R11.2 16.19,16.73 15.88,16.41 | v18,21.38 23.28,21.38 24.08,22.17 v24.08,25.5
  Bottom 0.61: U1.4 15.88,16.41 v17.99,16.41 | v17.99,16.41 v18,16.41 | R8.2 v18,8.95 19.72,8.95 R16.2 | v17.99,16.41 C29.1 | v11.88,43.18 9.53,43.18 8.69,42.34 v8.69,38.43 L3.1 | v56.79,52.28 v56.79,45.4
  Bottom 0.813: v63.75,62.83 63.75,59.24 v56.79,52.28
  Bottom 1.016: v81.99,31.6 79.32,31.6 76.66,34.27 v76.66,42.51 76.66,60.29 v74.12,62.83
_2V6  (via drill 0.6 pad 1.42)
  Top 0.61: L2.2 v83.8,44.68
  Top 0.813: IC5.2
  Top 1.016: IC5.2 IC5.TAB | C54.1 IC5.2 | C51.+ IC5.TAB | IC5.TAB 79.98,48.49 v83.8,44.68
  Bottom 0.61: L1.2 90.55,42.29 88.16,44.68 v83.8,44.68
A3V  (via drill 0.6 pad 1.42)  (1 unrouted)
  Top 0.305: IC4.22 17.58,37.28 16.43,38.43 v15.12,38.43
  Top 0.406: R4.2 24.34,42.74 25.29,42.74 25.29,43.98 | C16.1 26.85,44.32 C59.1 | C59.1 | C59.1 26.85,51.33 26.11,52.07 24.31,52.07 | C55.1 18.53,54.98 17.86,54.3 17.86,50.16 19.26,48.77 19.26,46.79 | C17.1 19.08,46.97 19.26,46.79 | 19.26,46.79 R3.2 19.27,45.04 18.29,45.04 18.29,43.81 R2.2 15.12,43.81 R10.2 R7.2 C21.1 | v15.12,38.43 C21.1 | C21.1
  Top 0.61: R5.2 C16.1 | RJ1.P4 24.31,52.07 RJ1.P5 C55.1
  Bottom 0.61: v15.12,38.43 L3.2
AN_3V
  Top 0.203: 44.86,44.73 44.86,42.49 U$3.30 42.71,42.49 C9.1
  Top 0.406: 44.86,44.73 44.03,45.56 C10.1 44.03,48.68 42.34,50.37 R18.2
D2_N
  Top 0.406: IC1.1 37.78,12.75 X3.2
D2_P
  Top 0.406: IC1.3 39.69,12.75 X3.3
D_N
  Top 0.203: IC1.6 37.78,17.69 38.51,18.41 38.51,19.65 46.69,27.84 U$3.54
D_P
  Top 0.203: IC1.4 39.69,17.69 38.96,18.41 38.96,19.46 47.09,27.59 U$3.55
DP_RST  (via drill 0.6 pad 1.42)
  Top 0.203: v26.54,34.75 26.54,38.18 26.14,38.58 26.14,39.5 27.53,40.89 U$3.34
  Top 0.305: IC4.29 13.65,32.55 12.72,33.48 10.97,33.48 R1.2
  Top 0.406: v5.99,35.76 8.68,35.76 R1.2
  Bottom 0.203: v5.99,35.76 9.4,35.76 11.28,33.88 25.68,33.88 v26.54,34.75
ECRSDV  (via drill 0.6 pad 1.42)
  Top 0.203: U$3.12 50.69,47.01 v51.54,47.85
  Top 0.305: IC4.40 18.08,24.92 20.52,22.48 28.85,22.48 v30.25,23.88 | v32.05,38.63 32.05,36.4 30.25,34.59 v30.25,28.75
  Bottom 0.203: v32.05,38.63 32.82,37.87 50.32,37.87 51.54,39.09 v51.54,47.85
  Bottom 0.406: v30.25,23.88 v30.25,28.75
EINT
  Top 0.305: IC4.7 22.69,32.05 22.68,32.05 22.4,32.05 22.12,31.77 22.12,29.01 22.73,28.4 24.08,28.4 R19.1
EMDC  (via drill 0.6 pad 1.42)
  Top 0.203: v57.33,23.47 56.06,23.47 53.09,26.43 U$3.70
  Top 0.305: IC4.31 6.73,31.55 5.99,32.28 v5.99,33.96
  Bottom 0.203: v5.99,33.96 7.11,35.08 9.37,35.08 11.07,33.38 30.45,33.38 30.99,32.84 36.32,32.84 39.32,35.84 51.44,35.84 53.09,34.19 53.09,26.44 56.06,23.47 v57.33,23.47
EMDIO  (via drill 0.6 pad 1.42)
  Top 0.203: U$3.71 53.49,26.75 55.65,24.59 57.94,24.59 v59.05,23.47
  Top 0.305: IC4.30 13.24,32.05 12.89,32.4 R15.2 11.19,32.4 9.63,33.96 v8.53,33.96
  Bottom 0.203: v8.53,33.96 9.63,33.96 10.72,32.87 30.25,32.87 30.79,32.33 36.52,32.33 39.52,35.33 51.21,35.33 52.58,33.96 52.58,26.24 56.46,22.35 57.94,22.35 v59.05,23.47
EREFCLK  (via drill 0.6 pad 1.42)
  Top 0.203: U$3.16 49.09,47.62 v48.33,48.39
  Top 0.305: U$7.3 7.4,28.71 8.18,29.49 v10.52,29.49 13.44,29.49 14,30.05 IC4.34 | v27.08,31.75 27.71,32.38 27.71,36.27 27.25,36.73 v27.25,39.04
  Bottom 0.203: v10.52,29.49 24.82,29.49 v27.08,31.75 | v27.25,39.04 27.96,39.75 32.51,39.75 33.88,38.38 47.17,38.38 48.33,39.54 v48.33,48.39
ERXD0  (via drill 0.6 pad 1.42)
  Top 0.203: U$3.41 40.86,38.09 38,35.23 v37.13,35.23
  Top 0.305: IC4.43 19.58,25 20.98,23.6 27.58,23.6 32.05,28.07 32.05,32.64 32.61,33.2 v32.61,35.23
  Bottom 0.406: v37.13,35.23 v32.61,35.23
ERXD1  (via drill 0.6 pad 1.42)
  Top 0.203: v35.89,33.96 37.44,33.96 41.17,37.69 U$3.42
  Top 0.305: IC4.44 20.08,25.36 21.23,24.21 27.33,24.21 31.45,28.32 v31.45,33.96
  Bottom 0.406: v31.45,33.96 v35.89,33.96
ERXERR
  Top 0.203: IC4.41 18.58,25.21 20.75,23.04 27.81,23.04 32.61,27.84 32.61,32.41 33.73,33.53 33.73,37.13 37.09,40.49 U$3.35
ETXD0  (via drill 0.6 pad 1.42)
  Top 0.203: U$3.86 63.87,38.49 v65.51,36.85
  Top 0.305: IC4.3 27.92,30.05 29.03,31.17 v29.03,37.47
  Bottom 0.203: v29.03,37.47 30.81,37.47 31.42,36.85 v65.51,36.85
ETXD1  (via drill 0.6 pad 1.42)
  Top 0.203: U$3.85 62.62,38.09 65.08,35.64 v66.73,35.64
  Top 0.305: IC4.4 27.55,30.55 28.32,31.32 28.32,36.52 27.86,36.98 27.86,37.97 28.52,38.63 v30.33,38.63
  Bottom 0.203: v30.33,38.63 31.6,37.36 64.44,37.36 65.05,37.97 65.96,37.97 66.73,37.21 v66.73,35.64
ETXEN  (via drill 0.6 pad 1.42)
  Top 0.203: v59.49,33.55 58.15,34.89 U$3.77
  Top 0.305: IC4.2 28.28,29.55 29.64,30.91 29.64,35.64 v30.35,36.35
  Bottom 0.203: v30.35,36.35 56.69,36.35 v59.49,33.55
FLASH_CS
  Top 0.203: U$2.1 20.3,12.34 22.2,14.25 22.2,18.36 24.05,20.22 29.77,20.22 34.24,24.69 34.24,34.65 36.45,36.85 38.2,36.85 40.64,39.29 U$3.38
  Top 0.406: 20.3,6.99 R13.1
  Top 0.61: U$2.1 20.3,6.99
GND  (via drill 0.5 pad 1.27, 0.5 pad 1.42, 0.6 pad 1.24, 0.6 pad 1.42, 0.61 pad 1.42)
  Top 0.198: U$3.75 v57.13,32.69
  Top 0.203: 46.76,40.09 U$3.36 38.85,40.07 38.19,39.43 v37.54,39.43 | U$3.53 46.29,28.66 44.35,26.72 | U$3.45 41.42,36.49 37.96,33.04 37.96,31.03 C1.2 | U$3.13 50.29,48.23 51.03,48.97 51.36,48.97 51.44,49.05 C38.2 | U$3.31 40.91,42.09 40.34,42.67 | U$3.63 50.29,24.23 51.89,22.63 51.39,22.13 C4.2 | U$3.84 62.23,37.69 63.27,36.65 62.84,36.22 C6.2 | U$3.92 61.47,40.89 62.11,41.53 C11.2
  Top 0.251: U2.4 86.94,41.38 85.89,42.41 C45.2 | U2.20 93.46,36.83 93.93,36.83 | 93.93,36.83 94.46,36.83 U2.22 94.46,33.73 C42.2 | U2.21 93.96,36.8 93.93,36.83 | U2.16 91.46,34.95 91.18,34.66 C41.2
  Top 0.254: IC1.2 38.91,14.36 38.91,15.19 39.19,15.47 41.27,15.47
  Top 0.305: v21.82,39.85 21.82,38.66 21.08,37.92 IC4.15 21.08,33.14 | IC4.19 19.08,38.38 18.08,39.38 C18.2 | IC4.35 14.36,29.55 13.54,28.73 | IC4.47 v21.58,25.5 | IC4.6 24.59,31.55 25.26,32.22 v25.26,36.02
  Top 0.406: JP5.GND1 v43.78,63.01
  other vias: 43.16,26.31 51.06,20.12 64.21,34.9 26.29,6.63 52.02,66.42 46.15,23.98 39.37,44 63.88,41.73 62.64,28.04 81.23,37.87 82.54,42.02 88.09,36.12 96.11,29.84 88.11,29.84 101.7,43.64 76.89,65.15 66.67,58.17 71.17,49.91 103.61,35.53 18.62,41.81 11.88,41.05 12.09,35.99 12.06,27.65 25.55,46.56 7.24,32.74 4.42,28.92 15.36,46.56 28.72,46.56 13.07,5.74 27.29,27.48 20.94,19.91 58.42,17.14 4.82,50.19 52.78,50.09 38.97,29.21 35.94,29.21 25.98,14.99 53.77,58.88 40.64,47.25 34.34,39.71 62.28,53.09
  pour Top (isolate 0.305, rank 2, no thermals): 0,0 0,68.58 109.86,68.58 109.86,0
  pour Bottom (isolate 0.305, no thermals): 0,68.58 0,0 109.86,0 109.86,68.58
LED_ACT
  Top 0.305: RJ1.G- 18.36,65.89 12.22,65.89 10.52,64.19 10.52,35.84 11.67,34.69 13.22,34.69 13.85,34.05 IC4.26
LED_LINK
  Top 0.305: IC4.28 14,33.05 12.96,34.09 11.4,34.09 9.91,35.59 9.91,64.44 11.96,66.5 20.14,66.5 22,64.64 RJ1.Y-
MCLR
  Top 0.203: R12.1 49.01,50.61 | R12.1 49.24,50.66 | U$3.15 49.49,50.32 R12.1
  Top 0.305: JP2.1 53.49,53.82 54.33,52.98 54.33,51.46 54.15,51.28 49.86,51.28 49.24,50.66
MISO  (via drill 0.6 pad 1.42)
  Top 0.203: v27.3,11.89 27.3,10.34 30.79,6.86 44.53,6.86 47.78,10.11 v52.63,10.11 | U$3.64 50.69,24.54 52.63,22.61 v52.63,16.51
  Top 0.305: v27.3,11.89 21.85,11.89 21.57,11.61 U$2.2
  Bottom 0.305: R16.1 20.32,11.5 20.32,11.89
  Bottom 0.406: U1.7 16.18,13.11 17.39,11.89 20.32,11.89 v27.3,11.89 | v52.63,10.11 v52.63,16.51
MOSI  (via drill 0.6 pad 1.42)
  Top 0.203: v25.98,16.84 27.84,18.69 32.97,18.69 44.88,30.61 44.88,35.51 44.7,35.69 U$3.47
  Top 0.584: v25.98,16.84 U$2.5
  Bottom 0.305: U1.3 14.37,17.58 25.25,17.58 v25.98,16.84
N$1
  Top 0.305: IC4.21 18.08,37.65 16.42,39.3 R7.1
N$2
  Top 0.203: 53.23,52.03 R9.1
  Top 0.305: C28.1 53.23,52.03
  Top 0.406: R9.1 | R12.2 47.94,51.84 C28.1
N$3
  Top 0.305: IC4.24 R6.1
N$4
  cutout Top: 44.07,42.44 44.07,39.37 45.26,39.37 45.26,42.44
N$6
  Top 0.305: IC4.20 18.58,38.01 17.14,39.45 17.14,42.05 R10.1
N$7
  cutout Top: 16.51,27.99 16.51,29.72 15.93,29.72 15.93,27.99
N$8  (via drill 0.6 pad 1.27)
  other vias: 104.86,17.07
N$9  (via drill 0.6 pad 1.27)
  other vias: 104.86,63.58
N$11  (via drill 0.6 pad 1.27)
  other vias: 5,63.58
N$12
  Top 0.61: R42.2 RJ1.G+
N$17
  Top 0.406: JP5.VBUS1 46.38,63.33
  Top 0.61: F1.1 46.38,63.33 46.38,62.18 45.77,61.57 X1.1
N$18
  Top 0.406: C36.2 R23.1
N$19
  Top 0.406: R43.1 28.7,63.07 RJ1.Y+
N$36  (via drill 0.6 pad 1.27)
  other vias: 5,5
PGEC
  Top 0.203: U$3.24 45.89,48.85 43.33,51.41 JP2.5
PGED
  Top 0.203: U$3.25 45.49,48.54 42.06,51.97 42.06,55.93 42.85,56.72 44.83,56.72 45.87,55.68 JP2.4
PH0
  Top 0.203: U$1.3 42.4,34.6 42.69,34.89 U$3.49
RA2
  Top 0.203: SV1.4 61.85,10.79 61.85,12.57 61.11,13.31 51.61,13.31 48.69,16.23 U$3.59
RA3
  Top 0.203: SV1.3 61.37,13.82 51.82,13.82 49.09,16.54 U$3.60
RA4
  Top 0.203: U$3.61 49.49,16.85 52.02,14.33 62.66,14.33 64.39,12.6 64.39,10.79 SV1.6
RA5
  Top 0.203: SV1.28 92.33,10.79 92.33,12.6 91.62,13.31 90.53,13.31 89.51,14.33 88.39,14.33 77.85,24.87 77.85,36.63 67.44,47.04 54.97,47.04 54.69,46.77 U$3.2
RA6
  Top 0.203: SV1.15 72.26,18.16 72.26,34.37 66.94,39.69 U$3.89
RA7
  Top 0.203: SV1.18 79.63,10.79 79.63,12.6 72.77,19.46 72.77,34.57 67.25,40.09 U$3.90
RA14
  Top 0.203: U$3.66 51.49,25.19 55.85,20.83 59.11,20.83 60.33,19.61 62.79,19.61 65.66,16.74 SV1.5
RD1
  Top 0.203: SV1.7 68.2,25.7 61.47,32.44 59.03,32.44 58.37,33.1 58.37,33.96 57.84,34.49 U$3.76
RD3
  Top 0.203: SV1.10 69.47,10.79 69.47,12.62 68.71,13.39 68.71,25.91 59.32,35.29 U$3.78
RD4
  Top 0.203: SV1.11 70.23,15.11 70.23,26.52 60.26,36.49 U$3.81
RD5
  Top 0.203: SV1.14 74.55,10.79 74.55,12.62 70.74,16.43 70.74,26.75 60.59,36.89 U$3.82
RD9
  Top 0.203: U$3.68 52.29,25.81 56.26,21.84 61.27,21.84 66.17,16.94 66.17,13.39 66.93,12.62 66.93,10.79 SV1.8
RD12
  Top 0.203: SV1.9 69.22,13.59 69.22,26.11 59.63,35.69 U$3.79
RD13
  Top 0.203: SV1.12 72.01,10.79 72.01,12.62 69.72,14.91 69.72,26.31 59.94,36.09 U$3.80
RD_N
  Top 0.254: 23.5,43.89 23.5,38.84 22.08,37.43 IC4.13 | 23.5,43.89 23.5,45.11 arc-90 23.88,45.49 23.99,45.49 arc90 24.37,45.87 24.37,45.88 arc90 23.99,46.27 23.88,46.27 arc-90 23.5,46.65 23.5,46.66 arc-90 23.88,47.04 23.99,47.04 arc90 24.37,47.42 24.37,47.43 arc90 23.99,47.81 23.88,47.81 arc-90 23.5,48.19 23.5,48.72 RJ1.RD- | R5.1 23.58,43.98 23.5,43.89
RD_P
  Top 0.254: 23.04,42.44 23.04,48.97 21.77,50.24 RJ1.RD+ | IC4.14 21.58,37.57 23.04,39.03 23.04,42.44 | R4.1 22.99,42.39 23.04,42.44
RE0
  Top 0.203: SV1.17 73.28,19.68 73.28,34.77 67.56,40.49 U$3.91
RE1
  Top 0.203: SV1.20 82.17,10.79 82.17,12.6 73.79,20.98 73.79,34.98 65.79,42.98 60.81,42.98 59.52,41.69 U$3.94
RE2
  Top 0.203: SV1.24 87.25,10.79 87.25,12.6 75.82,24.03 75.82,35.79 66.6,45.01 59.99,45.01 58.28,43.29 U$3.98
RE3
  Top 0.203: U$3.99 57.97,43.69 59.79,45.52 66.83,45.52 76.33,36.02 76.33,24.26 SV1.23
RE4
  Top 0.203: SV1.26 89.79,10.79 89.79,12.6 89.08,13.31 87.99,13.31 76.83,24.46 76.83,36.22 67.03,46.02 59.59,46.02 57.66,44.09 U$3.100
RE5
  Top 0.203: SV1.27 91.85,13.82 90.73,13.82 89.71,14.83 88.59,14.83 78.36,25.07 78.36,36.83 67.64,47.55 54.76,47.55 54.29,47.08 U$3.3
REG_OUT
  Top 0.305: 17.08,34.65 IC4.23 17.08,36.92 16.74,37.26 C19.1 | 17.08,34.65 19.58,34.65 IC4.18 19.58,40.13 C18.1 | 17.08,34.65 16.58,34.15 IC4.37 C24.1
  Top 0.406: C19.1 12.57,37.25 C32.1
RG0
  Top 0.203: SV1.16 77.09,10.79 77.09,12.6 71.75,17.93 71.75,34.16 66.62,39.29 U$3.88
RG1
  Top 0.203: SV1.13 71.25,16.64 71.25,33.96 66.31,38.89 U$3.87
RG12
  Top 0.203: SV1.22 84.71,10.79 84.71,12.6 74.8,22.5 74.8,35.38 66.19,43.99 60.4,43.99 58.9,42.49 U$3.96
RG13
  Top 0.203: U$3.97 58.59,42.89 60.2,44.5 66.4,44.5 75.31,35.59 75.31,22.73 SV1.21
RG14
  Top 0.203: U$3.95 59.21,42.09 60.6,43.48 65.99,43.48 74.3,35.18 74.3,21.21 SV1.19
RG15
  Top 0.203: SV1.25 89.31,13.82 88.19,13.82 77.34,24.66 77.34,36.42 67.22,46.54 56.27,46.54 55.62,45.89 U$3.1
RX_DV
  Top 0.305: IC4.39 17.58,26.03 R20.2
SCK  (via drill 0.6 pad 1.42)
  Top 0.203: U$2.6 22.84,18.26 24.28,19.71 29.97,19.71 34.75,24.49 34.75,34.44 36.65,36.35 38.41,36.35 40.95,38.89 U$3.39
  Top 0.305: U$2.6 22.84,14.25 23.95,13.13 v25.98,13.13
  Bottom 0.305: U1.5 14.37,15.24 15.85,15.24 17.96,13.13 v25.98,13.13
SCL
  Top 0.203: U$3.58 48.29,15.92 51.41,12.8 59.84,12.8 SV1.1
SD_CS  (via drill 0.6 pad 1.42)
  Top 0.203: U$3.44 41.11,36.89 37.16,32.94 37.16,26.19 30.18,19.2 26.61,19.2 v25.98,18.58
  Bottom 0.305: U1.2 15.88,18.61 | 16.26,18.48 R11.1
  Bottom 0.406: 15.88,18.61 16.06,18.43 R11.1 16.36,18.58 v25.98,18.58
SD_PRESENT  (via drill 0.6 pad 1.42)
  Top 0.203: v28.57,10.65 28.57,9.78 30.99,7.37 44.32,7.37 47.49,10.54 U$3.56
  Bottom 0.305: 16.09,10.65 R8.1 v28.57,10.65
  Bottom 0.61: U1.CD1 R8.1
SDA
  Top 0.203: U$3.57 47.89,15.61 51.21,12.29 57.81,12.29 SV1.2
SOSCI
  Top 0.203: X2.1 55.29,26.7 53.89,28.1 U$3.72
  Top 0.406: X2.1 C20.2
SOSCO
  Top 0.203: X2.2 55.3,29.2 54.29,30.21 U$3.73
  Top 0.406: X2.2 C23.2
TD_N
  Top 0.254: IC4.16 20.58,45.52 | 20.58,45.52 20.58,46.3 arc-90 21.01,46.74 21.24,46.74 arc90 21.68,47.17 21.68,47.18 arc90 21.24,47.61 21.01,47.61 arc-90 20.58,48.05 20.58,48.05 arc-90 21.01,48.49 21.24,48.49 arc90 21.68,48.92 21.68,48.93 arc90 21.24,49.36 21.01,49.36 arc-90 20.58,49.8 20.58,50.72 RJ1.TD- | R3.1 20.71,45.39 20.58,45.52
TD_P
  Top 0.254: IC4.17 20.08,43.61 | 20.08,43.61 20.08,49.37 19.23,50.22 RJ1.TD+ | R2.1 19.88,43.81 20.08,43.61
U2_RX
  Top 0.203: U$3.32 40.07,41.69 37.74,44.02 35.23,44.02 34.47,44.78 34.47,47.17 35.13,47.83 JP3.3
U2_TX
  Top 0.203: U$3.26 42.32,44.09 41.12,45.29 JP3.2
VBUS  (via drill 0.6 pad 1.42)
  Top 0.203: U$3.51 45.49,30.51 36.25,21.26 36.25,15.47
  Top 0.254: IC1.5 38.56,16.66 38.56,15.75 38.28,15.47 36.25,15.47
  Top 0.406: C13.1 52.06,60.52 52.07,60.52 | 36.25,15.47 36.25,13.71 X3.1
  Top 0.61: F1.2 52.07,60.52 | C30.+ 98.68,15.24
  Top 0.813: X3.1 C27.1 | 52.07,60.52 54.5,60.52 IC2.3 | IC5.3 | C53.1 71.12,55.43 | C53.1 | IC5.3 | C27.1 | v35.23,9.35 C27.1
  Top 1.016: IC2.3 57.21,60.52 57.86,59.87 C12.+ 60.88,57.86 63.32,55.42 C52.+ C53.1 IC5.3 | v78.31,45.92 78.31,52.55 75.44,55.42 IC5.3 | v80.47,33.55 80.47,26.85 89.53,17.78 98.68,17.78 98.68,15.24 SV1.31 SV1.32 98.68,6.48 97.16,4.95 v35.23,4.95 C5.+
  Bottom 0.813: v35.23,9.35 v35.23,4.95
  Bottom 1.016: v78.31,45.92 78.31,35.71 v80.47,33.55
VS_AGND
  Top 0.251: U2.47 90.46,45.02 88.86,46.62 C35.2 | U2.41 93.46,45.33 93.84,45.33 93.96,45.21 | U2.40 93.96,45.21 | 93.96,45.21 93.96,47.2 C34.2 | U2.37 95.46,45.04 96.65,46.23 99.44,46.23 99.76,46.55 C33.2
  Top 0.406: C35.2 R25.1 85.61,48.92 C39.1 | C37.1 C33.2 | 85.71,53.37 85.61,53.47 | C34.2 95.19,48.42 R33.2
  Top 0.61: C39.1 85.61,53.47 85.61,55.12 | 93.32,56.03 C36.1 R33.2 | 85.61,55.12 85.61,55.89 | R34.2 85.61,55.12 | C37.1 99.76,54.8
  pour Top (isolate 0.305, no thermals): 85.09,68.71 85.09,46.99 102.36,46.99 102.36,53.59 99.06,56.9 99.06,68.71
VS_AVDD  (via drill 0.6 pad 1.42)
  Top 0.251: C35.1 90.56,46.62 91.46,45.73 U2.45 91.46,43.43 92.46,43.43 | C34.1 92.46,46.76 U2.43 92.46,43.43 | C33.1 96.71,47.41 94.96,45.66 U2.38 94.96,43.43 | 94.96,43.43 92.46,43.43 | 94.96,43.43 96.04,43.43 v96.9,44.3
  Top 0.406: v96.9,44.3 98.2,45.59 101.46,45.59 C58.1
  Bottom 0.61: L1.1 94.89,42.29 v96.9,44.3
VS_CVDD
  Top 0.251: C45.1 85.62,40.88 U2.5 89.48,40.88 | 89.48,40.88 89.48,43.36 | 95.46,39.88 U2.24 95.46,34.72 C48.1 | 95.46,39.88 95.96,40.38 U2.31 C47.1 | 89.48,40.88 89.48,39.88 | 89.48,39.88 95.46,39.88 | 89.48,39.88 U2.7 83.15,39.88 C46.1
  Top 0.254: 89.48,43.36 88.16,44.68 L2.1
  Top 0.61: C47.1 C57.1
VS_DREQ
  Top 0.203: U2.8 84.59,39.38 84.07,38.86 84.07,37.19 83.46,36.58 80.75,36.58 68.25,49.07 54.15,49.07 53.09,48.01 U$3.6
VS_MISO  (via drill 0.6 pad 1.42)
  Top 0.203: U$3.65 51.09,24.88 55.65,20.32 58.01,20.32 v58.75,19.58
  Top 0.251: 101.37,37.52 101.37,38.05 99.54,39.88 99,39.88
  Top 0.254: 98.34,39.88 U2.30 99,39.88 | 101.37,37.52 101.37,26.62 97.51,22.76 93.95,22.76 93.37,22.17 v91.57,22.17
  Bottom 0.254: v58.75,19.58 62,19.58 63.63,21.21 88.67,21.21 89.64,22.17 v91.57,22.17
VS_MOSI  (via drill 0.6 pad 1.42)
  Top 0.203: U$3.67 51.89,25.5 56.06,21.34 60.17,21.34 v60.78,20.73
  Top 0.251: 100.81,37.29 100.81,37.82 99.25,39.38 98.72,39.38
  Top 0.254: U2.29 98.72,39.38 | 100.81,37.29 100.81,26.85 97.28,23.32 v92.89,23.32
  Bottom 0.254: v92.89,23.32 89.97,23.32 88.44,21.79 63.4,21.79 62.33,20.73 v60.78,20.73
VS_N$9
  Top 0.251: U2.18 92.46,32.07 | 92.46,32.07 92.46,29.23 93.06,28.63 R35.2 | Y3.1 92.53,32.14 92.46,32.07
  Top 0.61: R35.2 C50.1
VS_N$13
  Top 0.251: U2.17 91.96,29.84 | 91.96,29.84 91.96,29.2 91.36,28.6 R35.1 | Y3.3 91.96,29.84
  Top 0.254: R35.1 91.36,27.59
  Top 0.61: R35.1 C49.1
VS_N$14
  Top 0.251: U2.46 90.96,45.36 89.71,46.61 89.71,49.55 90.56,50.41 R22.2
  Top 0.406: R22.2 R31.2
VS_N$15
  Top 0.251: U2.42 92.96,46.2 93.32,46.56 R23.2
VS_N$16
  Top 0.251: U2.39 94.46,45.97 96.38,47.89 R24.2
  Top 0.406: R24.2 96.38,50.08 96.88,50.57 96.88,52.02 R32.2
VS_N$17
  Top 0.251: U2.44 91.96,45.94 91.52,46.38 91.52,48.55 90.56,48.55 R25.2
VS_N$24
  Top 0.305: 98.06,49.48 R24.1
  Top 0.406: C37.2 98.06,49.48
VS_N$25
  Top 0.406: C39.2 R22.1
VS_N$26
  Top 0.251: U2.10 87.56,38.38 86.97,38.38 R29.1
VS_N$27
  Top 0.251: U2.9 85.75,38.88 R28.1
VS_N$28
  Top 0.251: U2.34 98.68,41.88 R27.1
VS_N$30
  Top 0.251: U2.33 99.95,41.38 R26.1
VS_N$34
  Top 0.251: U2.26 R30.1
VS_N$35
  Top 0.406: R31.1 C43.1
VS_N$36
  Top 0.406: R32.1 C44.1
VS_N$37
  Top 0.61: C44.2 96.86,55.07 R33.1 96.89,60.8 95.3,62.38 J1.RING1
VS_N$38
  Top 0.406: C43.2 90.56,55.1 R34.1
  Top 0.61: 90.56,55.1 90.56,57.39 91.55,58.38 J1.TIP
VS_SCK  (via drill 0.6 pad 1.42)
  Top 0.203: U$3.69 52.69,26.12 56.46,22.35 v62.33,22.35
  Top 0.251: 100.25,37.06 100.25,37.59 98.96,38.88 98.43,38.88
  Top 0.254: U2.28 98.43,38.88 | 100.25,37.06 100.25,27.08 97.05,23.88 93.95,23.88 93.37,24.46 v91.57,24.46
  Bottom 0.254: v91.57,24.46 90.3,24.46 88.19,22.35 v62.33,22.35
VS_XCS
  Top 0.203: 89.38,36.83 89.38,35.51 88.67,34.8 81.81,34.8 68.05,48.56 54.36,48.56 53.49,47.7 U$3.5
  Top 0.254: U2.23 94.96,37.22 94.69,37.49 90.04,37.49 89.38,36.83
VS_XDCS
  Top 0.203: 89.96,35.3 88.95,34.29 81.61,34.29 67.84,48.06 54.56,48.06 53.89,47.39 U$3.4
  Top 0.254: U2.13 89.96,35.3
VS_XRST
  Top 0.203: U2.3 88.43,41.91 87.35,41.91 85.98,43.28 80.64,43.28 R36.1 | 80.57,43.31 R36.1 | U$3.7 52.69,48.32 53.95,49.58 68.45,49.58 74.4,43.64 80.39,43.64 R36.1